# EAGLE design OpenBook (EAGLE 9.7.0)
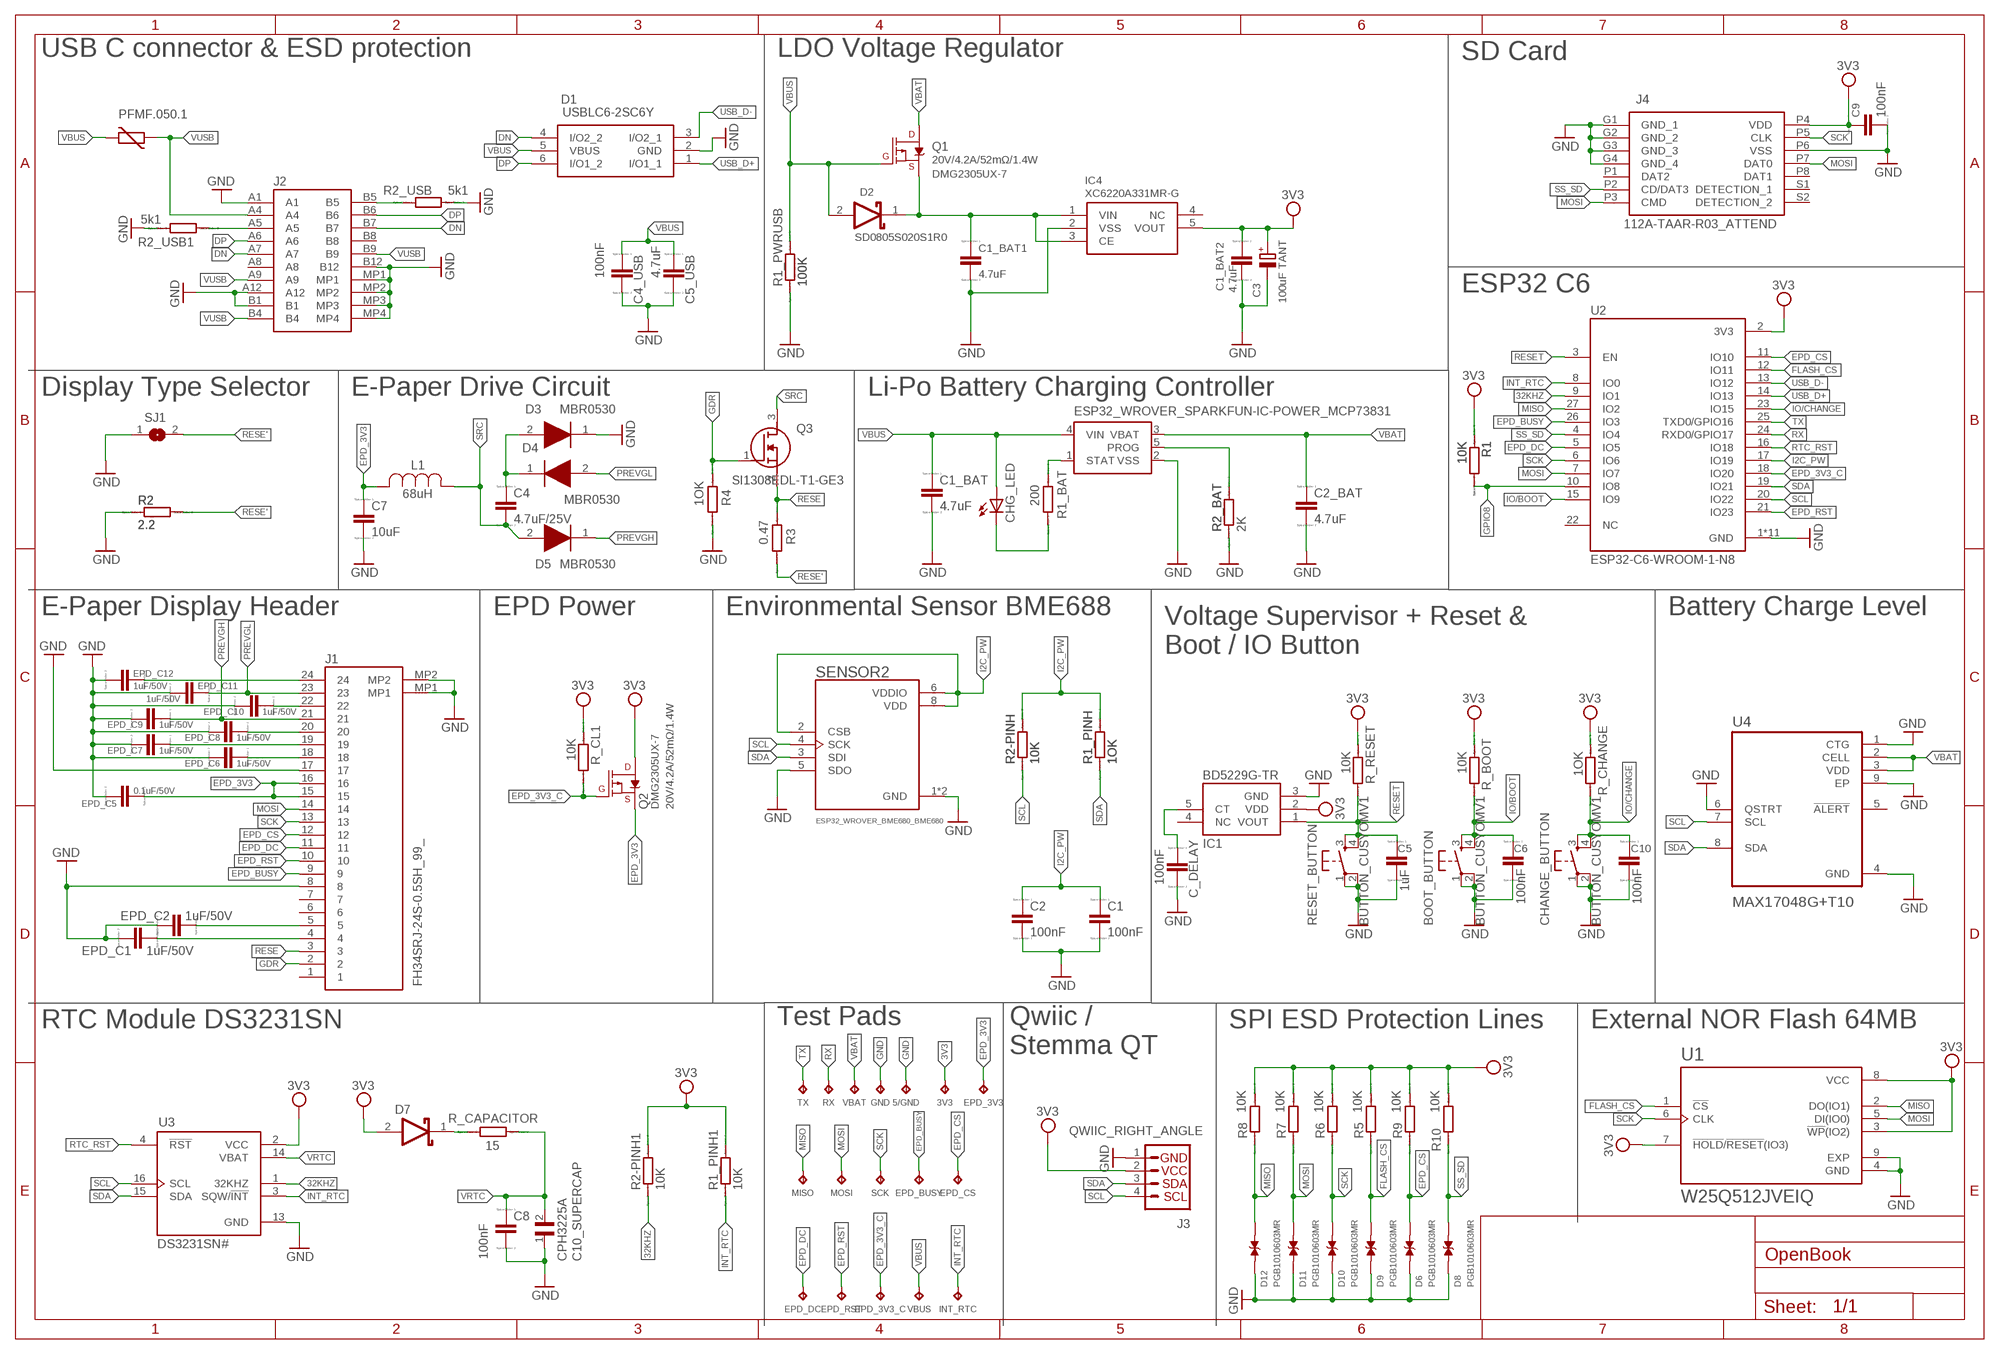
[diagram p0: schematic, sheet 1]

## Parts
3V3  TPTP20R  [TP20R]
5/GND  TPTP20R  [TP20R]
BOOT_BUTTON  BUTTON_CUSYOMV1  [MYBUTTON]
C1  100nF  ESP32_WROVER_EAGLE-LTSPICE_CC0402  [ESP32_WROVER_EAGLE-LTSPICE_C0402]
C1_BAT  4.7uF  ESP32_WROVER_EAGLE-LTSPICE_CC0402  [ESP32_WROVER_EAGLE-LTSPICE_C0402]
C1_BAT1  4.7uF  ESP32_WROVER_EAGLE-LTSPICE_CC0402  [ESP32_WROVER_EAGLE-LTSPICE_C0402]
C1_BAT2  4.7uF  ESP32_WROVER_EAGLE-LTSPICE_CC0402  [ESP32_WROVER_EAGLE-LTSPICE_C0402]
C2  100nF  ESP32_WROVER_EAGLE-LTSPICE_CC0402  [ESP32_WROVER_EAGLE-LTSPICE_C0402]
C2_BAT  4.7uF  ESP32_WROVER_EAGLE-LTSPICE_CC0402  [ESP32_WROVER_EAGLE-LTSPICE_C0402]
C3  100uF TANT  RCL_CPOL-EUCT3528  [RCL_CT3528]
C4  4.7uF/25V  ESP32_WROVER_EAGLE-LTSPICE_CC0402  [ESP32_WROVER_EAGLE-LTSPICE_C0402]
C4_USB  100nF  ESP32_WROVER_EAGLE-LTSPICE_CC0402  [ESP32_WROVER_EAGLE-LTSPICE_C0402]
C5  1uF  ESP32_WROVER_EAGLE-LTSPICE_CC0402  [ESP32_WROVER_EAGLE-LTSPICE_C0402]
C5_USB  4.7uF  ESP32_WROVER_EAGLE-LTSPICE_CC0402  [ESP32_WROVER_EAGLE-LTSPICE_C0402]
C6  100nF  ESP32_WROVER_EAGLE-LTSPICE_CC0402  [ESP32_WROVER_EAGLE-LTSPICE_C0402]
C7  10uF  ESP32_WROVER_EAGLE-LTSPICE_CC0402  [ESP32_WROVER_EAGLE-LTSPICE_C0402]
C8  100nF  ESP32_WROVER_EAGLE-LTSPICE_CC0402  [ESP32_WROVER_EAGLE-LTSPICE_C0402]
C9  100nF  ESP32_WROVER_EAGLE-LTSPICE_CC0402  [ESP32_WROVER_EAGLE-LTSPICE_C0402]
C10  100nF  ESP32_WROVER_EAGLE-LTSPICE_CC0402  [ESP32_WROVER_EAGLE-LTSPICE_C0402]
C10_SUPERCAP  CPH3225A  [CAPCP3225X100N]
C_DELAY  100nF  ESP32_WROVER_EAGLE-LTSPICE_CC0402  [ESP32_WROVER_EAGLE-LTSPICE_C0402]
CHANGE_BUTTON  BUTTON_CUSYOMV1  [MYBUTTON]
CHG_LED  ADAFRUIT_LEDCHIP-LED0603  [ADAFRUIT_CHIP-LED0603]
D1  USBLC6-2SC6Y  [SOT95P280X145-6N]
D2  ESP32_WROVER_AVX---SD0805S020S1R0_AVX_SD0805S020S1R0_0_0AVX_SD0805S020S1R0_0_0  [ESP32_WROVER_AVX---SD0805S020S1R0_AVX_SD0805S020S1R0_0]
D3  MBR0530  [SOD3716X135N]
D4  MBR0530  [SOD3716X135N]
D5  MBR0530  [SOD3716X135N]
D6  PGB1010603MR  [DIOC1608X36N]
D7  ESP32_WROVER_AVX---SD0805S020S1R0_AVX_SD0805S020S1R0_0_0AVX_SD0805S020S1R0_0_0  [ESP32_WROVER_AVX---SD0805S020S1R0_AVX_SD0805S020S1R0_0]
D8  PGB1010603MR  [DIOC1608X36N]
D9  PGB1010603MR  [DIOC1608X36N]
D10  PGB1010603MR  [DIOC1608X36N]
D11  PGB1010603MR  [DIOC1608X36N]
D12  PGB1010603MR  [DIOC1608X36N]
EPD_3V3  TPTP20R  [TP20R]
EPD_3V3_C  TPTP20R  [TP20R]
EPD_BUSY  TPTP20R  [TP20R]
EPD_C1  1uF/50V  ESP32_WROVER_EAGLE-LTSPICE_CC0402  [ESP32_WROVER_EAGLE-LTSPICE_C0402]
EPD_C2  1uF/50V  ESP32_WROVER_EAGLE-LTSPICE_CC0402  [ESP32_WROVER_EAGLE-LTSPICE_C0402]
EPD_C5  0.1uF/50V  ESP32_WROVER_EAGLE-LTSPICE_CC0402  [ESP32_WROVER_EAGLE-LTSPICE_C0402]
EPD_C6  1uF/50V  ESP32_WROVER_EAGLE-LTSPICE_CC0402  [ESP32_WROVER_EAGLE-LTSPICE_C0402]
EPD_C7  1uF/50V  ESP32_WROVER_EAGLE-LTSPICE_CC0402  [ESP32_WROVER_EAGLE-LTSPICE_C0402]
EPD_C8  1uF/50V  ESP32_WROVER_EAGLE-LTSPICE_CC0402  [ESP32_WROVER_EAGLE-LTSPICE_C0402]
EPD_C9  1uF/50V  ESP32_WROVER_EAGLE-LTSPICE_CC0402  [ESP32_WROVER_EAGLE-LTSPICE_C0402]
EPD_C10  1uF/50V  ESP32_WROVER_EAGLE-LTSPICE_CC0402  [ESP32_WROVER_EAGLE-LTSPICE_C0402]
EPD_C11  1uF/50V  ESP32_WROVER_EAGLE-LTSPICE_CC0402  [ESP32_WROVER_EAGLE-LTSPICE_C0402]
EPD_C12  1uF/50V  ESP32_WROVER_EAGLE-LTSPICE_CC0402  [ESP32_WROVER_EAGLE-LTSPICE_C0402]
EPD_CS  TPTP20R  [TP20R]
EPD_DC  TPTP20R  [TP20R]
EPD_RST  TPTP20R  [TP20R]
GND  TPTP20R  [TP20R]
IC1  BD5229G-TR  [SOT95P280X125-5N]
IC4  XC6220A331MR-G  [SOT95P280X120-5N]
INT_RTC  TPTP20R  [TP20R]
J1  FH34SRJ-24S-0.5SH_99_  [FH34SRJ24S05SH99]
J2  SAMACSYS_PARTS_USB4110-GF-A  [SAMACSYS_PARTS_USB4110GFA]
J3  QWIIC_RIGHT_ANGLE  QWIIC_CONNECTORJS-1MM  [JST04_1MM_RA]
J4  112A-TAAR-R03_ATTEND  [112ATAARR03ATTEND]
L1  744043680IND_4828-WE-TPC_WRE  [IND_4828-WE-TPC_WRE]
MISO  TPTP20R  [TP20R]
MOSI  TPTP20R  [TP20R]
PFMF.050.1  ESP32C6_VARISTORCN1812  [ESP32C6_VARISTOR_CT/CN1812]
Q1  20V/4.2A/52mΩ/1.4W  ESP32_WROVER_SPARKFUN-DISCRETESEMI_MOSFET_PCH-DMG2305UX-7  [ESP32_WROVER_SPARKFUN-DISCRETESEMI_SOT23-3]
Q2  20V/4.2A/52mΩ/1.4W  ESP32_WROVER_SPARKFUN-DISCRETESEMI_MOSFET_PCH-DMG2305UX-7  [ESP32_WROVER_SPARKFUN-DISCRETESEMI_SOT23-3]
Q3  SI1308EDL-T1-GE3  [SOT65P210X110-3N]
R1  10K  ESP32_WROVER_EAGLE-LTSPICE_RR0402  [ESP32_WROVER_EAGLE-LTSPICE_R0402]
R1_BAT  200  ESP32_WROVER_EAGLE-LTSPICE_RR0402  [ESP32_WROVER_EAGLE-LTSPICE_R0402]
R1_PINH  1OK  ESP32_WROVER_EAGLE-LTSPICE_RR0402  [ESP32_WROVER_EAGLE-LTSPICE_R0402]
R1_PINH1  10K  ESP32_WROVER_EAGLE-LTSPICE_RR0402  [ESP32_WROVER_EAGLE-LTSPICE_R0402]
R1_PWRUSB  100K  ESP32_WROVER_EAGLE-LTSPICE_RR0402  [ESP32_WROVER_EAGLE-LTSPICE_R0402]
R2  2.2  ESP32_WROVER_EAGLE-LTSPICE_RR0402  [ESP32_WROVER_EAGLE-LTSPICE_R0402]
R2-PINH  10K  ESP32_WROVER_EAGLE-LTSPICE_RR0402  [ESP32_WROVER_EAGLE-LTSPICE_R0402]
R2-PINH1  10K  ESP32_WROVER_EAGLE-LTSPICE_RR0402  [ESP32_WROVER_EAGLE-LTSPICE_R0402]
R2_BAT  2K  ESP32_WROVER_EAGLE-LTSPICE_RR0402  [ESP32_WROVER_EAGLE-LTSPICE_R0402]
R2_USB  5k1  ESP32_WROVER_EAGLE-LTSPICE_RR0402  [ESP32_WROVER_EAGLE-LTSPICE_R0402]
R2_USB1  5k1  ESP32_WROVER_EAGLE-LTSPICE_RR0402  [ESP32_WROVER_EAGLE-LTSPICE_R0402]
R3  0.47  ESP32_WROVER_EAGLE-LTSPICE_RR0402  [ESP32_WROVER_EAGLE-LTSPICE_R0402]
R4  1OK  ESP32_WROVER_EAGLE-LTSPICE_RR0402  [ESP32_WROVER_EAGLE-LTSPICE_R0402]
R5  10K  ESP32_WROVER_EAGLE-LTSPICE_RR0402  [ESP32_WROVER_EAGLE-LTSPICE_R0402]
R6  10K  ESP32_WROVER_EAGLE-LTSPICE_RR0402  [ESP32_WROVER_EAGLE-LTSPICE_R0402]
R7  10K  ESP32_WROVER_EAGLE-LTSPICE_RR0402  [ESP32_WROVER_EAGLE-LTSPICE_R0402]
R8  10K  ESP32_WROVER_EAGLE-LTSPICE_RR0402  [ESP32_WROVER_EAGLE-LTSPICE_R0402]
R9  10K  ESP32_WROVER_EAGLE-LTSPICE_RR0402  [ESP32_WROVER_EAGLE-LTSPICE_R0402]
R10  10K  ESP32_WROVER_EAGLE-LTSPICE_RR0402  [ESP32_WROVER_EAGLE-LTSPICE_R0402]
R_BOOT  10K  ESP32_WROVER_EAGLE-LTSPICE_RR0402  [ESP32_WROVER_EAGLE-LTSPICE_R0402]
R_CAPACITOR  15  ESP32_WROVER_EAGLE-LTSPICE_RR0402  [ESP32_WROVER_EAGLE-LTSPICE_R0402]
R_CHANGE  1OK  ESP32_WROVER_EAGLE-LTSPICE_RR0402  [ESP32_WROVER_EAGLE-LTSPICE_R0402]
R_CL1  10K  ESP32_WROVER_EAGLE-LTSPICE_RR0402  [ESP32_WROVER_EAGLE-LTSPICE_R0402]
R_RESET  10K  ESP32_WROVER_EAGLE-LTSPICE_RR0402  [ESP32_WROVER_EAGLE-LTSPICE_R0402]
RESET_BUTTON  BUTTON_CUSYOMV1  [MYBUTTON]
RX  TPTP20R  [TP20R]
SCK  TPTP20R  [TP20R]
SENSOR2  ESP32_WROVER_BME680_BME680  [ESP32_WROVER_BME680_PSON80P300X300X100-8N]
SJ1  SJ  [SJ]
TX  TPTP20R  [TP20R]
U0  ESP32_WROVER_SPARKFUN-IC-POWER_MCP73831  [ESP32_WROVER_SPARKFUN-IC-POWER_SOT23-5]
U1  W25Q512JVEIQ  [SON127P600X800X80-9N]
U2  ESP32-C6-WROOM-1-N8  [XCVR_ESP32-C6-WROOM-1-N8]
U3  DS3231SN#  [SOIC127P1032X265-16N]
U4  MAX17048G+T10  [SON50P200X200X80-9N]
VBAT  TPTP20R  [TP20R]
VBUS  TPTP20R  [TP20R]

## Nets
3V3 [power_lines]: 3V3.TP C1_BAT2.1 C3.+ C9.1 D7.2(ANODE) IC1.2(VDD) IC4.5(VOUT) J3.2 J4.P4(VDD) Q2.3(D) R1.1 R1_PINH1.2 R2-PINH1.2 R5.2 R6.2 R7.2 R8.2 R9.2 R10.2 R_BOOT.1 R_CHANGE.1 R_CL1.1 R_RESET.1 U1.3(!WP!(IO2)) U1.7(!HOLD!/!RESET!(IO3)) U1.8(VCC) U2.2(3V3) U3.2(VCC)
32KHZ: R2-PINH1.1 U2.9(IO1) U3.1(32KHZ)
DN: D1.4(I/O2_2) J2.A7 J2.B7
DP: D1.6(I/O1_2) J2.A6 J2.B6
EPD_3V3 [power_lines]: C7.1 EPD_3V3.TP EPD_C5.1 J1.15 J1.16 L1.2 Q2.2(S)
EPD_3V3_C [power_lines]: EPD_3V3_C.TP Q2.1(G) R_CL1.2 U2.18(IO20)
EPD_BUSY: EPD_BUSY.TP J1.9 U2.26(IO3)
EPD_CS: D6.2 EPD_CS.TP J1.12 R9.1 U2.11(IO10)
EPD_DC: EPD_DC.TP J1.11 U2.5(IO5)
EPD_RST: EPD_RST.TP J1.10 U2.21(IO23)
FLASH_CS: D9.2 R5.1 U1.1(!CS) U2.12(IO11)
GDR: J1.2 Q3.1(G) R4.2
GND: 5/GND.TP BOOT_BUTTON.1 BOOT_BUTTON.2 C1.2 C1_BAT1.2 C1_BAT2.2 C1_BAT.2 C2.2 C2_BAT.2 C3.- C4_USB.2 C5.2 C5_USB.2 C6.2 C7.2 C8.2 C9.2 C10.2 C10_SUPERCAP.1 C_DELAY.2 CHANGE_BUTTON.1 CHANGE_BUTTON.2 D1.2(GND) D4.1(K) D6.1 D8.1 D9.1 D10.1 D11.1 D12.1 EPD_C1.2 EPD_C2.2 EPD_C5.2 EPD_C6.2 EPD_C7.2 EPD_C8.2 EPD_C9.2 EPD_C10.2 EPD_C11.2 EPD_C12.2 GND.TP IC1.3(GND) IC4.2(VSS) J1.8 J1.17 J1.MP1 J1.MP2 J2.A1 J2.A12 J2.B1 J2.B12 J2.MP1 J2.MP2 J2.MP3 J2.MP4 J3.1 J4.G1(GND_1) J4.G2(GND_2) J4.G3(GND_3) J4.G4(GND_4) J4.P6(VSS) R1_PWRUSB.1 R2.1 R2_BAT.1 R2_USB1.1 R2_USB.2 R4.1 RESET_BUTTON.1 RESET_BUTTON.2 SENSOR2.1(GND) SENSOR2.5(SDO) SENSOR2.7(GND) SJ1.1 U0.2(VSS) U1.4(GND) U1.9(EXP) U2.1(GND) U2.28(GND) U2.29_1(GND) U2.29_2(GND) U2.29_3(GND) U2.29_4(GND) U2.29_5(GND) U2.29_6(GND) U2.29_7(GND) U2.29_8(GND) U2.29_9(GND) U3.13(GND) U4.1(CTG) U4.4(GND) U4.6(QSTRT) U4.9(EP)
GPIO8: R1.2 U2.10(IO8)
I2C_PW: C1.1 C2.1 R1_PINH.2 R2-PINH.2 SENSOR2.2(CSB) SENSOR2.6(VDDIO) SENSOR2.8(VDD) U2.17(IO19)
INT_RTC: INT_RTC.TP R1_PINH1.1 U2.8(IO0) U3.3(SQW/!INT)
IO/BOOT: BOOT_BUTTON.3 BOOT_BUTTON.4 C6.1 R_BOOT.2 U2.15(IO9)
IO/CHANGE: C10.1 CHANGE_BUTTON.3 CHANGE_BUTTON.4 R_CHANGE.2 U2.23(IO15)
MISO: D12.2 MISO.TP R8.1 U1.2(DO(IO1)) U2.27(IO2)
MOSI: D11.2 J1.14 J4.P3(CMD) J4.P7(DAT0) MOSI.TP R7.1 U1.5(DI(IO0)) U2.7(IO7)
N$1: J2.A5 R2_USB1.2
N$2: J2.B5 R2_USB.1
N$3: C1_BAT1.1 D2.1(CATHODE) IC4.1(VIN) IC4.3(CE) Q1.2(S)
N$4: R1_BAT.2 U0.1(STAT)
N$5: C4.1 D3.1(K) D4.2(A)
N$6: CHG_LED.C R1_BAT.1
N$7: D7.1(CATHODE) R_CAPACITOR.2
N$8: R2_BAT.2 U0.5(PROG)
N$9: EPD_C12.1 J1.24
N$10: C_DELAY.1 IC1.5(CT)
N$11: EPD_C10.1 J1.22
N$13: EPD_C7.1 J1.19
N$14: EPD_C8.1 J1.20
N$15: EPD_C6.1 J1.18
N$19: EPD_C1.1 J1.4
N$20: EPD_C2.1 J1.5
PREVGH: D5.1(K) EPD_C9.1 J1.21
PREVGL: D3.2(A) EPD_C11.1 J1.23
RESE: J1.3 Q3.2(S) R3.2
RESE': R2.2 R3.1 SJ1.2
RESET: C5.1 IC1.1(VOUT) R_RESET.2 RESET_BUTTON.3 RESET_BUTTON.4 U2.3(EN)
RTC_RST: U2.16(IO18) U3.4(!RST)
RX: RX.TP U2.24(RXD0/GPIO17)
SCK: D10.2 J1.13 J4.P5(CLK) R6.1 SCK.TP U1.6(CLK) U2.6(IO6)
SCL: J3.4 R2-PINH.1 SENSOR2.4(SCK) U2.20(IO22) U3.16(SCL) U4.7(SCL)
SDA: J3.3 R1_PINH.1 SENSOR2.3(SDI) U2.19(IO21) U3.15(SDA) U4.8(SDA)
SRC: C4.2 D5.2(A) L1.1 Q3.3(D)
SS_SD: D8.2 J4.P2(CD/DAT3) R10.1 U2.4(IO4)
TX: TX.TP U2.25(TXD0/GPIO16)
USB_D+: D1.1(I/O1_1) U2.14(IO13)
USB_D-: D1.3(I/O2_1) U2.13(IO12)
VBAT [power_lines]: C2_BAT.1 Q1.3(D) U0.3(VBAT) U4.2(CELL) U4.3(VDD) VBAT.TP
VBUS [power_lines]: C1_BAT.1 C4_USB.1 C5_USB.1 CHG_LED.A D1.5(VBUS) D2.2(ANODE) PFMF.050.1.2 Q1.1(G) R1_PWRUSB.2 U0.4(VIN) VBUS.TP
VRTC [power_lines]: C8.1 C10_SUPERCAP.2 R_CAPACITOR.1 U3.14(VBAT)
VUSB [power_lines]: J2.A4 J2.A9 J2.B4 J2.B9 PFMF.050.1.1
Unconnected: IC1.4(NC) IC4.4(NC) J1.1 J1.6 J1.7 J2.A8 J2.B8 J4.P1(DAT2) J4.P8(DAT1) J4.S1(DETECTION_1) J4.S2(DETECTION_2) U2.22(NC) U4.5(!ALERT)

## Notes on the sheet
- SD Card
- USB C connector & ESD protection | LDO Voltage Regulator
- DMG2305UX-7
- SD0805S020S1R0
- ESP32 C6
- Display Type Selector | E-Paper Drive Circuit | Li-Po Battery Charging Controller
- 68uH
- E-Paper Display Header | EPD Power | Environmental Sensor BME688 | Battery Charge Level
- Voltage Supervisor + Reset &
  Boot / IO Button
- DMG2305UX-7
- RTC Module DS3231SN | SPI ESD Protection Lines | External NOR Flash 64MB
- Test Pads
- Qwiic / 
  Stemma QT

## Library data of the parts
3V3 5/GND EPD_3V3 EPD_3V3_C EPD_BUSY EPD_CS EPD_DC EPD_RST GND INT_RTC MISO MOSI RX SCK TX VBAT VBUS = DeskAssistant v19 v1:TP: Test pad
BOOT_BUTTON CHANGE_BUTTON RESET_BUTTON = DeskAssistant v19 v1:BUTTON_CUSYOMV1
C1 C1_BAT C1_BAT1 C1_BAT2 C2 C2_BAT C4 C4_USB C5 C5_USB C6-C10 C_DELAY EPD_C1 EPD_C2 EPD_C5-EPD_C12 = DeskAssistant v19 v1:ESP32_WROVER_EAGLE-LTSPICE_C: CAPACITOR, European symbol; SPICEMODEL: NONE; SPICEPREFIX: C
C3 = DeskAssistant v19 v1:RCL_CPOL-EU: POLARIZED CAPACITOR, European symbol; SPICEPREFIX: C
C10_SUPERCAP = DeskAssistant v19 v1:CPH3225A: Cap 0.011F 3.3V 1210 Flat Check availability <https://pricing.snapeda.com/parts/CPH3225A/Seiko%20Instruments/view-part?ref=eda>; AVAILABILITY: Not in stock; CHECK_PRICES: https://www.snapeda.com/parts/CPH3225A/Seiko+Instruments/view-part/?ref=eda; DESCRIPTION: 11 mF (EDLC) Supercapacitor 3.3 V 1210 (3225 Metric) - -; MF: Seiko Instruments; MP: CPH3225A; PACKAGE: 1210 Seiko; PRICE: None; PURCHASE-URL: https://www.snapeda.com/api/url_track_click_mouser/?unipart_id=562593&manufacturer=Seiko Instruments&part_name=CPH3225A&search_term=None; SNAPEDA_LINK: https://www.snapeda.com/parts/CPH3225A/Seiko+Instruments/view-part/?ref=snap
CHG_LED = DeskAssistant v19 v1:ADAFRUIT_LED: LED OSRAM: - CHIPLED LG R971, LG N971, LY N971, LG Q971, LY Q971, LO R971, LY R971 LH N974, LH R974 LS Q976, LO Q976, LY Q976 LO Q996 - Hyper CHIPLED LW Q18S LB Q993, LB Q99A, LB R99A - SideLED LS A670, LO A670, LY A670, LG A670, LP A670 LB A673, LV A673, LT A673, LW A673 LH A674 LY A675 LS A676, LA A676, LO A676, LY A676, LW A676 LS A679, LY A679, LG A679 - Hyper Micro SIDELED® LS Y876, LA Y876, LO Y876, LY Y876 LT Y87S - SmartLED LW L88C, LW L88S LB L89C, LB L89S, LG L890 LS L89K, LO L89K, LY L89K LS L896, LA L896, LO L896, LY L896 - TOPLED LS T670, LO T670, LY T670, LG T670, LP T670 LSG T670, LSP T670, LSY T670, LOP T670, LYG T670 LG T671, LOG T671, LSG T671 LB T673, LV T673, LT T673, LW T673 LH T674 LS T676, LA T676, LO T676, LY T676, LB T676, LH T676, LSB T676, LW T676 LB T67C, LV T67C, LT T67C, LS T67K, LO T67K, LY T67K, LW E67C LS E67B, LA E67B, LO E67B, LY E67B, LB E67C, LV E67C, LT E67C LW T67C LS T679, LY T679, LG T679 LS T770, LO T770, LY T770, LG T770, LP T770 LB T773, LV T773, LT T773, LW T773 LH T774 LS E675, LA E675, LY E675, LS T675 LS T776, LA T776, LO T776, LY T776, LB T776 LHGB T686 LT T68C, LB T68C - Hyper Mini TOPLED® LB M676 - Mini TOPLED Santana® LG M470 LS M47K, LO M47K, LY M47K Source: http://www.osram.convergy.de/
D1 = DeskAssistant v19 v1:USBLC6-2SC6Y: Low Cap. ESD Protection Auto SOT-23-6 STMicroelectronics USBLC6-2SC6Y, Dual Uni-Directional TVS Diode Array, 6-Pin SOT-23 Source: Datasheet <https://componentsearchengine.com/Datasheets/1/USBLC6-2SC6Y.pdf> Check availability <https://pricing.snapeda.com/parts/USBLC6-2SC6Y/STMicroelectronics/view-part?ref=eda>; AVAILABILITY: In Stock; CHECK_PRICES: https://www.snapeda.com/parts/USBLC6-2SC6Y/STMicroelectronics/view-part/?ref=eda; DESCRIPTION: 17V Clamp 5A (8/20µs) Ipp Tvs Diode Surface Mount SOT-23-6; MF: STMicroelectronics; MP: USBLC6-2SC6Y; PACKAGE: SOT-23-6 STMicroelectronics; PRICE: None; SNAPEDA_LINK: https://www.snapeda.com/parts/USBLC6-2SC6Y/STMicroelectronics/view-part/?ref=snap
D2 D7 = DeskAssistant v19 v1:ESP32_WROVER_AVX---SD0805S020S1R0_AVX_SD0805S020S1R0_0_0: Schottky Barrier Rectifier Diode; CENTROID_NOT_SPECIFIED: No; DATASHEET: http://datasheets.avx.com/schottky.pdf; DIGIKEY_DESCRIPTION: DIODE SCHOTTKY 20V 1A 0805; DIGIKEY_PART_NUMBER: 478-7800-1-ND; LEAD_FREE: yes; MF: AVX; MOUSER_PART_NUMBER: 581-SD0805S020S1R0; PACKAGE: 0805 (2012 metric); PREFIX: D; ROHS: yes; TEMPERATURE_RANGE_HIGH: +125°C; TEMPERATURE_RANGE_LOW: -55°C
D3-D5 = DeskAssistant v19 v1:MBR0530: ON SEMICONDUCTOR - MBR0530 - DIODE, SCHOTTKY, 0.5A, 30V, SOD-123 Source: Datasheet <http://www.onsemi.com/pub/Collateral/MBR0530T1-D.PDF> Check availability <https://pricing.snapeda.com/parts/MBR0530/ON%20Semiconductor/view-part?ref=eda>; AVAILABILITY: In Stock; CHECK_PRICES: https://www.snapeda.com/parts/MBR0530/Onsemi/view-part/?ref=eda; DESCRIPTION: Diode Schottky 30 V 500mA Surface Mount SOD-123; MF: ON Semiconductor; MP: MBR0530; PACKAGE: SOD-123-2 ON Semiconductor; PRICE: None; PURCHASE-URL: https://www.snapeda.com/api/url_track_click_mouser/?unipart_id=179458&manufacturer=ON Semiconductor&part_name=MBR0530&search_term=None; SNAPEDA_LINK: https://www.snapeda.com/parts/MBR0530/Onsemi/view-part/?ref=snap
D6 D8-D12 = DeskAssistant v19 v1:PGB1010603MR: Check availability <https://pricing.snapeda.com/parts/PGB1010603MR/Littelfuse%20Inc./view-part?ref=eda>; AVAILABILITY: In Stock; CHECK_PRICES: https://www.snapeda.com/parts/PGB1010603MR/Littelfuse/view-part/?ref=eda; DESCRIPTION: 150V (Typ) Clamp - Ipp Tvs Diode Surface Mount 0603 (1608 Metric); MF: Littelfuse Inc.; MP: PGB1010603MR; PACKAGE: 0603 Littelfuse Inc.; PRICE: None; PURCHASE-URL: https://www.snapeda.com/api/url_track_click_mouser/?unipart_id=5659453&manufacturer=Littelfuse Inc.&part_name=PGB1010603MR&search_term=None; SNAPEDA_LINK: https://www.snapeda.com/parts/PGB1010603MR/Littelfuse/view-part/?ref=snap
IC1 = DeskAssistant v19 v1:BD5229G-TR: Voltage Detector with Adjustable Delay Time: CMOS processes are utilized to develop high precision, low current consumption CMOS reset ICs that allow arbitrary setting of the delay time. The extensive lineup includes both Nch Open Drain and CMOS output types in a wide range of detection voltages (from 2.3V to 6.0V, in 0.1V steps), enabling selection of the ideal solution based on customer requirements. In addition, the entire series is of course both lead-free and RoHS-compliant. Source: Datasheet <https://datasheet.datasheetarchive.com/originals/distributors/Datasheets_SAMA/f2b9741ef86007909f138d561a359946.pdf>; DESCRIPTION: Voltage Detector with Adjustable Delay Time: CMOS processes are utilized to develop high precision, low current consumption CMOS reset ICs that allow arbitrary setting of the delay time. The extensive lineup includes both Nch Open Drain and CMOS output types in a wide range of detection voltages (from 2.3V to 6.0V, in 0.1V steps), enabling selection of the ideal solution based on customer requirements. In addition, the entire series is of course both lead-free and RoHS-compliant.; HEIGHT: 1.25mm; MANUFACTURER_NAME: ROHM Semiconductor; MANUFACTURER_PART_NUMBER: BD5229G-TR; MOUSER_PART_NUMBER: 755-BD5229G-TR; MOUSER_PRICE-STOCK: https://www.mouser.co.uk/ProductDetail/ROHM-Semiconductor/BD5229G-TR?qs=4kLU8WoGk0vvnhrrYwdszw%3D%3D
IC4 = DeskAssistant v19 v1:XC6220A331MR-G: LDO Voltage Regulators Source: Datasheet <https://www.torexsemi.com/file/xc6220/XC6220.pdf>; DESCRIPTION: LDO Voltage Regulators; HEIGHT: 1.2mm; MANUFACTURER_NAME: Torex; MANUFACTURER_PART_NUMBER: XC6220A331MR-G; MOUSER_PART_NUMBER: 865-XC6220A331MR-G; MOUSER_PRICE-STOCK: https://www.mouser.co.uk/ProductDetail/Torex-Semiconductor/XC6220A331MR-G?qs=AsjdqWjXhJ8ZSWznL1J0gg%3D%3D
J1 = DeskAssistant v19 v1:FH34SRJ-24S-0.5SH_99_: 24 Position FFC, FPC Connector Contacts, Top and Bottom 0.020" (0.50mm) Surface Mount, Right Angle Source: Datasheet <https://www.hirose.com/en/product/document?clcode=CL0580-1255-6-99&productname=FH34SRJ-24S-0.5SH(99)&series=FH34SRJ&documenttype=2DDrawing&lang=en&documentid=0000990903>; DESCRIPTION: 24 Position FFC, FPC Connector Contacts, Top and Bottom 0.020" (0.50mm) Surface Mount, Right Angle; HEIGHT: 1.1mm; MANUFACTURER_NAME: Hirose; MANUFACTURER_PART_NUMBER: FH34SRJ-24S-0.5SH(99); MOUSER_PART_NUMBER: 798-FH34SRJ24S05SH99; MOUSER_PRICE-STOCK: https://www.mouser.co.uk/ProductDetail/Hirose-Connector/FH34SRJ-24S-0.5SH99?qs=vcbW%252B4%252BSTIpKBl5ap9J8Fw%3D%3D
J2 = DeskAssistant v19 v1:SAMACSYS_PARTS_USB4110-GF-A: CONN USB 2.0 TYPE-C R/A SMT Source: Datasheet <https://gct.co/files/drawings/usb4110.pdf>; DESCRIPTION: CONN USB 2.0 TYPE-C R/A SMT; HEIGHT: 3.26mm; MANUFACTURER_NAME: GCT (GLOBAL CONNECTOR TECHNOLOGY); MANUFACTURER_PART_NUMBER: USB4110-GF-A; MOUSER_PART_NUMBER: 640-USB4110-GF-A; MOUSER_PRICE-STOCK: https://www.mouser.co.uk/ProductDetail/GCT/USB4110-GF-A?qs=KUoIvG%2F9IlYiZvIXQjyJeA%3D%3D
J3 = DeskAssistant v19 v1:QWIIC_CONNECTOR: SparkFun I2C Standard Qwiic Connector An SMD 1mm pitch JST connector makes it easy and quick (get it? Qwiic?) to connect I2C devices to each other. The Qwiic system <http://www.sparkfun.com/qwiic> enables fast and solderless connection between popular platforms and various sensors and actuators. We carry 200mm <https://www.sparkfun.com/products/14204>, 100mm <https://www.sparkfun.com/products/14205>, 50mm <https://www.sparkfun.com/products/14206>, and breadboard friendly <https://www.sparkfun.com/products/14207> Qwiic cables. We also offer 10 pcs strips <https://www.sparkfun.com/products/14323> the SMD connectors.; PROD_ID: CONN-13694
J4 = DeskAssistant v19 v1:112A-TAAR-R03_ATTEND: Micro SD Card Socket, Push-Push Type, Top Mount, SMT, H=1.83mm, 10u Source: Datasheet <https://www.attend.com.tw/data/download/file/112A-TAAR-R03.pdf>; DESCRIPTION: Micro SD Card Socket, Push-Push Type, Top Mount, SMT, H=1.83mm, 10u; HEIGHT: 1.9mm; MANUFACTURER_NAME: ATTEND; MANUFACTURER_PART_NUMBER: 112A-TAAR-R03 ATTEND
L1 = DeskAssistant v19 v1:744043680; COPYRIGHT: Copyright (C) 2024 Ultra Librarian. All rights reserved.; MANUFACTURER_PART_NUMBER: 744043680; MFR_NAME: Wurth Electronics
PFMF.050.1 = DeskAssistant v19 v1:ESP32C6_VARISTOR: VARISTOR
Q1 Q2 = DeskAssistant v19 v1:ESP32_WROVER_SPARKFUN-DISCRETESEMI_MOSFET_PCH: P-channel MOSFETs Voltage controlled devices that allow control of high current outputs. SparkFun Products: SparkFun ESP32 Thing <https://www.sparkfun.com/products/13907> SparkFun ESP8266 Thing <https://www.sparkfun.com/products/13231> SparkFun Pi Servo HAT V2 <https://www.sparkfun.com/products/15316> DMG2305UX-7 (20V/4.2A/SOT23-3); PROD_ID: TRAN-14388
Q3 = DeskAssistant v19 v1:SI1308EDL-T1-GE3: MOSFET N-Ch 30V 1.5A TrenchFET SC70 Vishay Si1308EDL-T1-GE3 N-channel MOSFET Transistor, 1.5 A, 30 V, 3-Pin SC-70 Source: Datasheet <https://componentsearchengine.com/Datasheets/1/SI1308EDL-T1-GE3.pdf> Check availability <https://pricing.snapeda.com/parts/SI1308EDL-T1-GE3/Vishay%20Siliconix/view-part?ref=eda>; AVAILABILITY: In Stock; CHECK_PRICES: https://www.snapeda.com/parts/SI1308EDL-T1-GE3/Vishay+Siliconix/view-part/?ref=eda; DESCRIPTION: Si1308EDL-T1-GE3 N-channel MOSFET Transistor, 1.5 A, 30 V, 3-Pin SC-70 | Siliconix / Vishay SI1308EDL-T1-GE3; MF: Vishay Siliconix; MP: SI1308EDL-T1-GE3; PACKAGE: SOT-323 Vishay Semiconductor; PRICE: None; PURCHASE-URL: https://www.snapeda.com/api/url_track_click_mouser/?unipart_id=274603&manufacturer=Vishay Siliconix&part_name=SI1308EDL-T1-GE3&search_term=None; SNAPEDA_LINK: https://www.snapeda.com/parts/SI1308EDL-T1-GE3/Vishay+Siliconix/view-part/?ref=snap
R1 R1_BAT R1_PINH R1_PINH1 R1_PWRUSB R2 R2-PINH R2-PINH1 R2_BAT R2_USB R2_USB1 R3-R10 R_BOOT R_CAPACITOR R_CHANGE R_CL1 R_RESET = DeskAssistant v19 v1:ESP32_WROVER_EAGLE-LTSPICE_R: RESISTOR, European symbol; SPICEMODEL: NONE; SPICEPREFIX: R
SENSOR2 = DeskAssistant v19 v1:ESP32_WROVER_BME680_BME680: Integrated Environmental Unit; AVAILABILITY: Unavailable; DESCRIPTION: Integrated Environmental Unit; MF: Bosch Sensortec; MP: BME680; PACKAGE: LGA-8 Bosch Tools; PRICE: None
SJ1 = DeskAssistant v19 v1:SJ: SMD solder JUMPER
U0 = DeskAssistant v19 v1:ESP32_WROVER_SPARKFUN-IC-POWER_MCP73831: MCP73831T Li-Ion, Li-Pol Controller Miniature single cell, fully integrated Li-Ion, Li-polymer charge management controller Datasheet <http://ww1.microchip.com/downloads/en/DeviceDoc/20001984g.pdf> SparkFun Products: SparkFun ESP32 Thing <https://www.sparkfun.com/products/13907> SparkFun 9DoF Razor IMU M0 <https://www.sparkfun.com/products/14001>; PROD_ID: IC-09995
U1 = DeskAssistant v19 v1:W25Q512JVEIQ: Check availability <https://pricing.snapeda.com/parts/W25Q512JVEIQ/Winbond%20Electronics/view-part?ref=eda>; AVAILABILITY: In Stock; CHECK_PRICES: https://www.snapeda.com/parts/W25Q512JVEIQ/Winbond+Electronics/view-part/?ref=eda; DESCRIPTION: FLASH - NOR Memory IC 512Mb (64M x 8) SPI - Quad I/O 133 MHz 8-WSON (8x6); MF: Winbond Electronics; MP: W25Q512JVEIQ; PACKAGE: Package; PRICE: None; SNAPEDA_LINK: https://www.snapeda.com/parts/W25Q512JVEIQ/Winbond+Electronics/view-part/?ref=snap
U2 = DeskAssistant v19 v1:ESP32-C6-WROOM-1-N8: Check availability <https://pricing.snapeda.com/parts/ESP32-C6-WROOM-1-N8/Espressif%20Systems/view-part?ref=eda>; AVAILABILITY: In Stock; CHECK_PRICES: https://www.snapeda.com/parts/ESP32-C6-WROOM-1-N8/Espressif+Systems/view-part/?ref=eda; DESCRIPTION: Multiprotocol Modules ESP32-C6 module, Wi-Fi 6 in 2.4 GHz band, Bluetooth 5, Zigbee 3.0 and Thread. ESP34-WROOM Compatible - ENGINEERING SAMPLE; MF: Espressif Systems; MP: ESP32-C6-WROOM-1-N8; PACKAGE: None; PRICE: None; SNAPEDA_LINK: https://www.snapeda.com/parts/ESP32-C6-WROOM-1-N8/Espressif+Systems/view-part/?ref=snap
U3 = DeskAssistant v19 v1:DS3231SN#: Real Time Clock Serial 16-Pin SOIC W T/R Check availability <https://pricing.snapeda.com/parts/DS3231SN%23/Analog%20Devices/view-part?ref=eda>; AVAILABILITY: In Stock; CHECK_PRICES: https://www.snapeda.com/parts/DS3231SN%23/Analog+Devices/view-part/?ref=eda; DESCRIPTION: Extremely Accurate I²C-Integrated RTC/TCXO/Crystal; MF: Analog Devices; MP: DS3231SN#; PACKAGE: SOIC-16 Maxim; PRICE: None; PURCHASE-URL: https://www.snapeda.com/api/url_track_click_mouser/?unipart_id=99048&manufacturer=Analog Devices&part_name=DS3231SN#&search_term=None; SNAPEDA_LINK: https://www.snapeda.com/parts/DS3231SN%23/Analog+Devices/view-part/?ref=snap
U4 = DeskAssistant v19 v1:MAX17048G+T10: Check availability <https://pricing.snapeda.com/parts/MAX17048G%2BT10/Analog%20Devices/view-part?ref=eda>; AVAILABILITY: In Stock; CHECK_PRICES: https://www.snapeda.com/parts/MAX17048G+T10/Analog+Devices/view-part/?ref=eda; DESCRIPTION: 3µA 1-Cell/2-Cell Fuel Gauge with ModelGauge; MF: Analog Devices; MP: MAX17048G+T10; PACKAGE: TDFN-8 Maxim; PRICE: None; PURCHASE-URL: https://www.snapeda.com/api/url_track_click_mouser/?unipart_id=329239&manufacturer=Analog Devices&part_name=MAX17048G+T10&search_term=None; SNAPEDA_LINK: https://www.snapeda.com/parts/MAX17048G+T10/Analog+Devices/view-part/?ref=snap

## Net classes
1 power_lines: width 0.3 mm

## Board
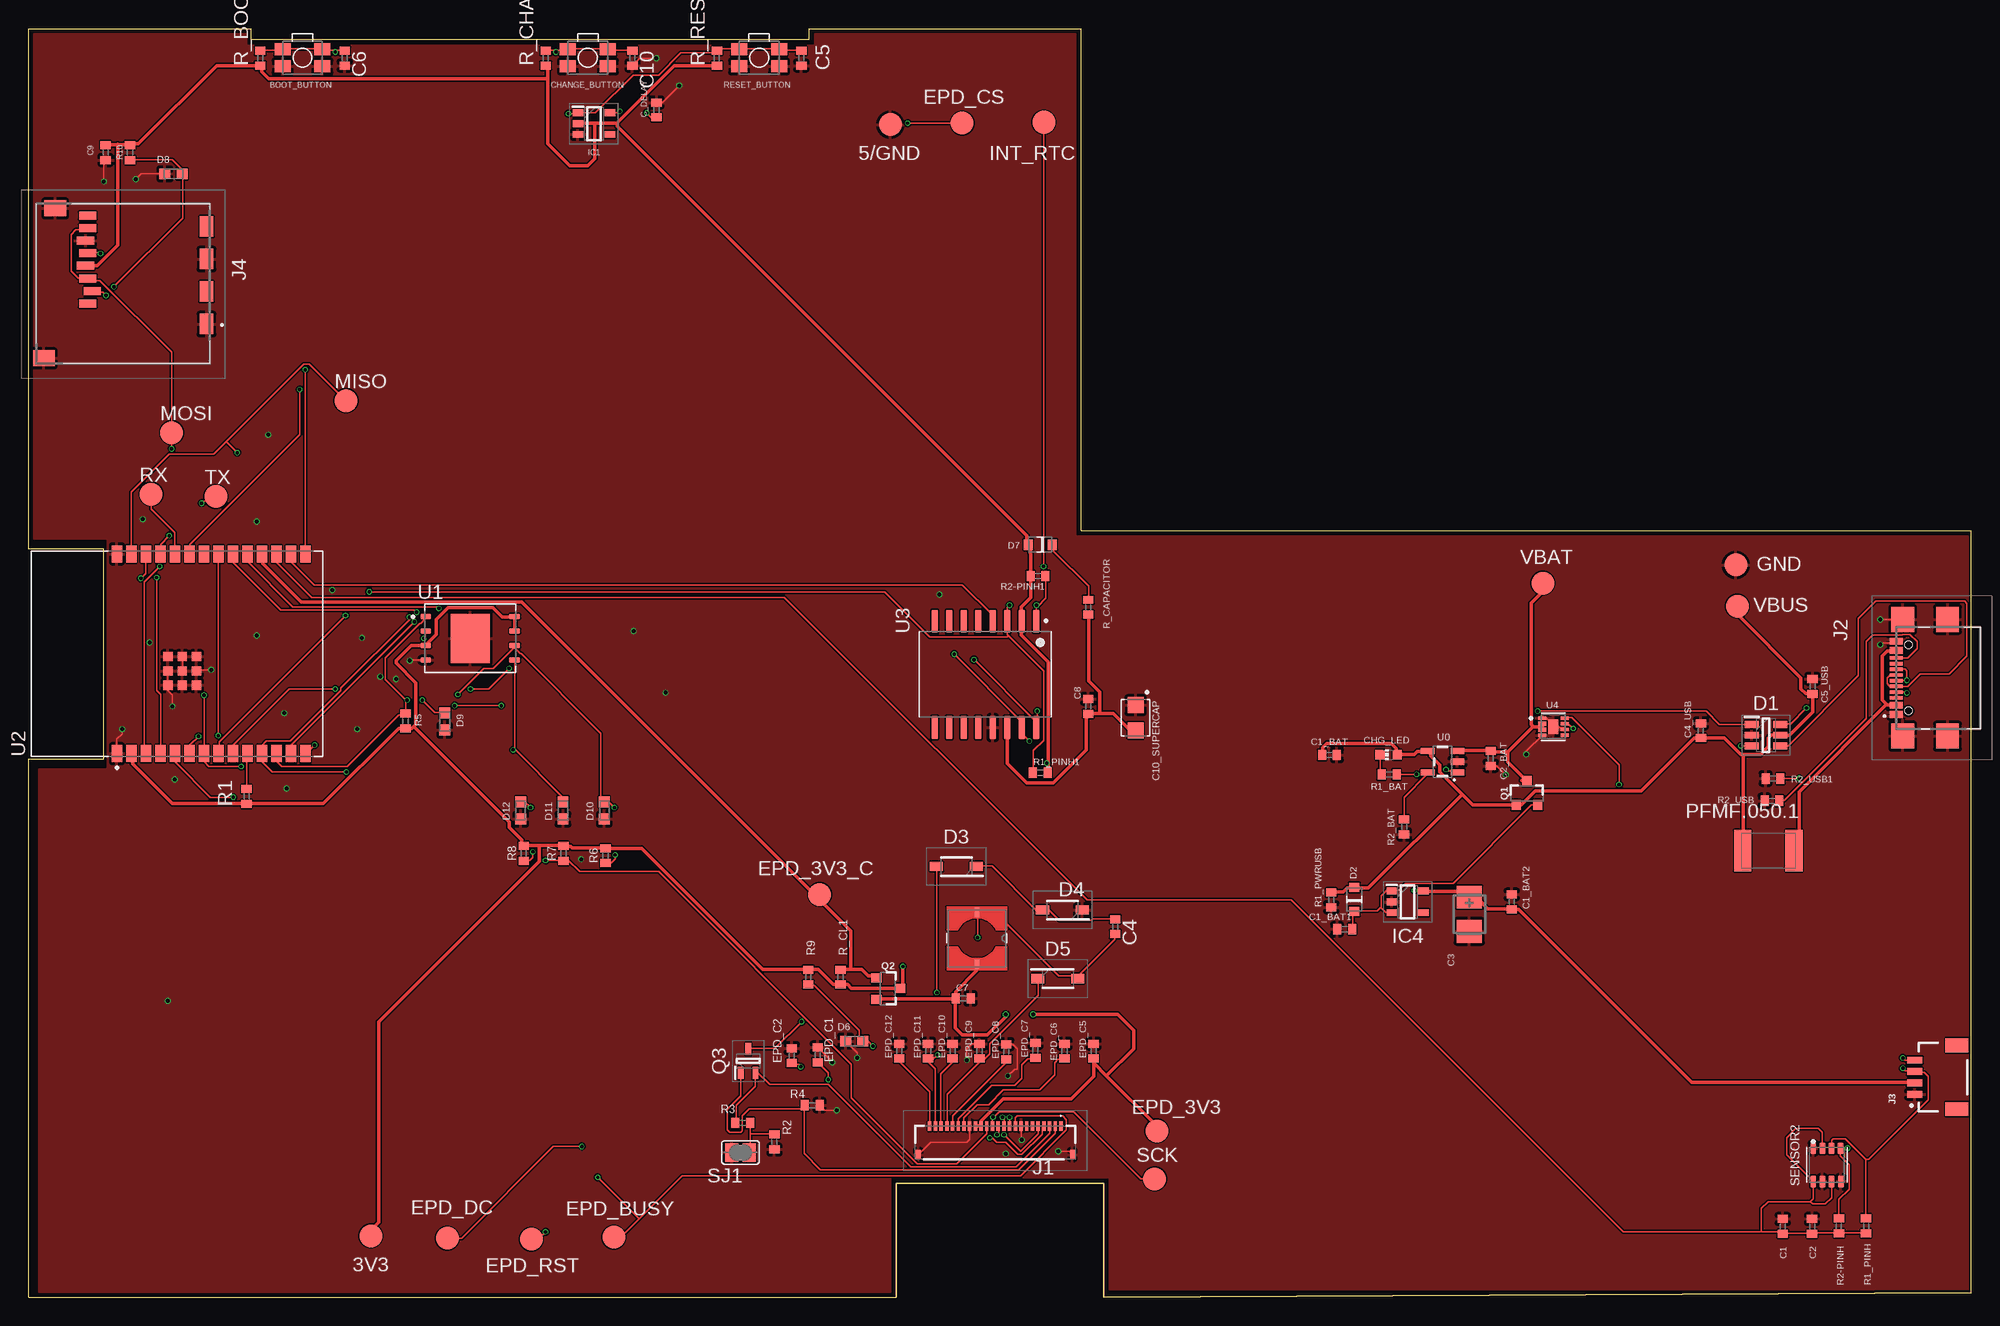
[diagram p1: board, top side]
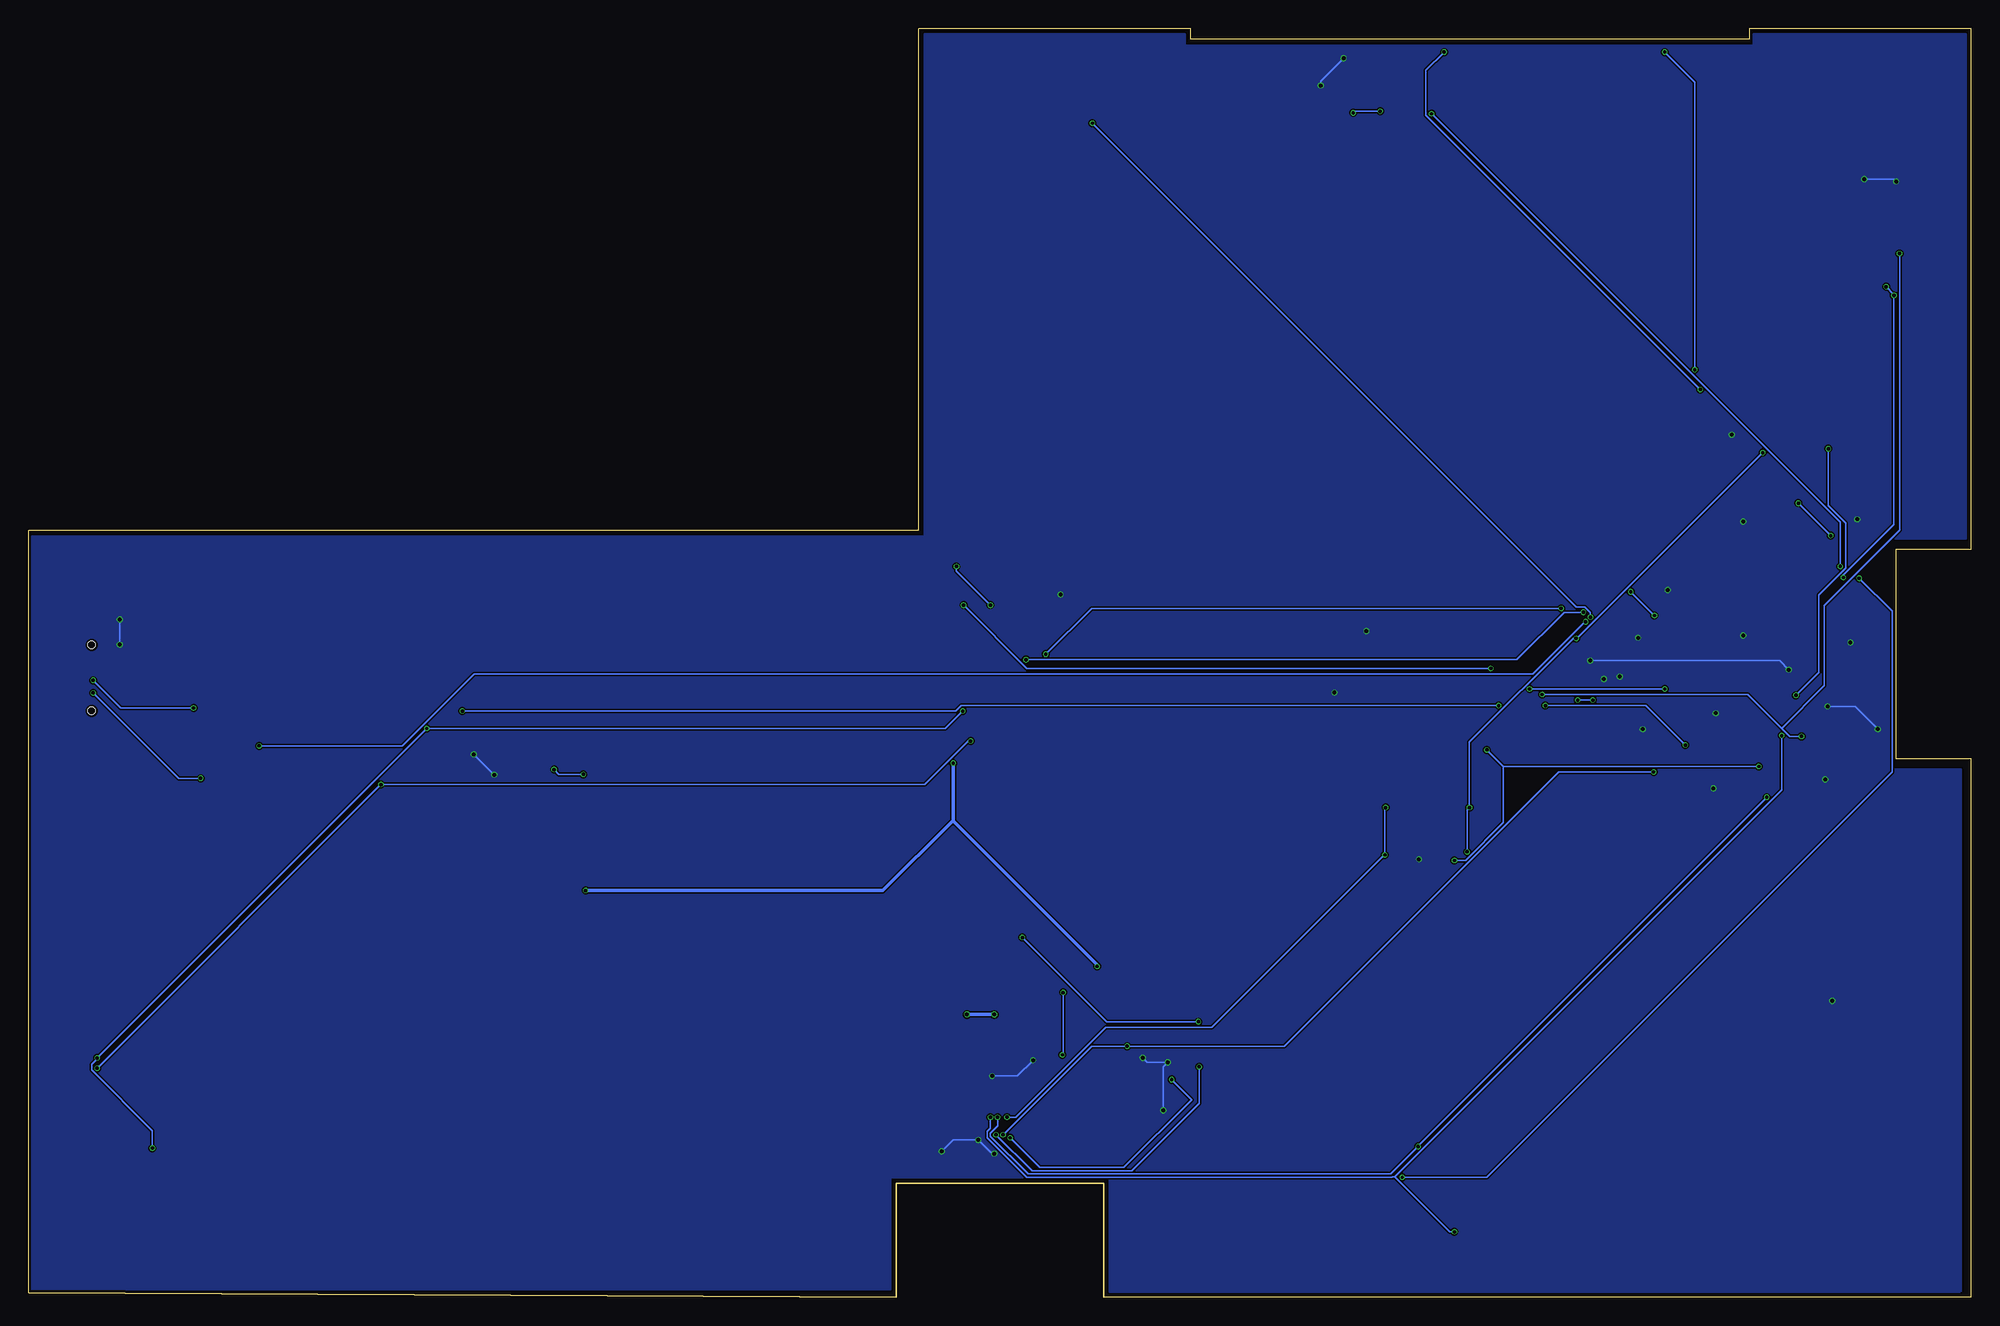
[diagram p2: board, bottom side, seen from below]

Size 170.2 x 111.2 mm. Coordinates in mm from the lower left corner, seen from the top.
Outline: 92.2,67.2 170.2,67.2 170.2,0.4 94.2,0 94.2,10 76,10 76,0 0,0 0,47.2 6.6,47.2 6.6,65.6 0,65.6 0,111.2 19.47,111.2 19.47,110.27 68.39,110.27 68.39,111.2 92.2,111.2 92.2,67.2
Copper layers (1*16): Top 0.035mm / dielectric 1.6mm / Bottom 0.035mm
Design rules "jlcpcb-2layers.dru *": minimum track width 0.15mm, minimum drill 0.3mm, track to track 5mil, track to pad 5mil, pad to pad 5mil, via to via 5mil, smd to smd 5mil, copper to edge 0.2mm, drill to drill 6mil, minimum pad ring 10mil, minimum via ring 3mil, stop-mask expansion 4mil, vias tented up to drill 0mil, thermal gap 10mil

### Footprints (pad centres in the part's own frame; a part is rotated, then mirrored left to right if it is on the bottom)
TP20R = smd 2 x 2: TP 0,0
MYBUTTON = smd 1.4 x 1.05: 1 1.75,0.75; 2 -1.75,0.75; 3 -1.75,-0.75; 4 1.75,-0.75
ESP32_WROVER_EAGLE-LTSPICE_C0402 = smd 0.7 x 0.9: 1 -0.65,0; 2 0.65,0
RCL_CT3528 = smd 2 x 2.2: + -1.5,0; - 1.5,0
CAPCP3225X100N = smd 1.4 x 1.4: 1 -1.1,0; 2 1.1,0
ADAFRUIT_CHIP-LED0603 = smd 0.8 x 0.8: A 0,-0.75; C 0,0.75
SOT95P280X145-6N = smd 1.2 x 0.6: 1 -1.25,0.95; 2 -1.25,0; 3 -1.25,-0.95; 4 1.25,-0.95; 5 1.25,0; 6 1.25,0.95
ESP32_WROVER_AVX---SD0805S020S1R0_AVX_SD0805S020S1R0_0 = smd 0.8 x 0.9: 1 -1.05,0; 2 1.05,0
SOD3716X135N = smd 1.15 x 0.8: 1 -1.75,0; 2 1.75,0
DIOC1608X36N = smd 0.97 x 0.94: 1 -0.75,0; 2 0.75,0
SOT95P280X125-5N = smd 0.9 x 0.6: 1 -1.4,0.95; 2 -1.4,0; 3 -1.4,-0.95; 4 1.4,-0.95; 5 1.4,0.95
SOT95P280X120-5N = smd 0.9 x 0.6: 1 -1.4,0.95; 2 -1.4,0; 3 -1.4,-0.95; 4 1.4,-0.95; 5 1.4,0.95
FH34SRJ24S05SH99 = smd 0.3 x 0.8: 1 5.75,1.45; 2 5.25,1.45; 3 4.75,1.45; 4 4.25,1.45; 5 3.75,1.45; 6 3.25,1.45; 7 2.75,1.45; 8 2.25,1.45; 9 1.75,1.45; 10 1.25,1.45; 11 0.75,1.45; 12 0.25,1.45; 13 -0.25,1.45; 14 -0.75,1.45; 15 -1.25,1.45; 16 -1.75,1.45; 17 -2.25,1.45; 18 -2.75,1.45; 19 -3.25,1.45; 20 -3.75,1.45; 21 -4.25,1.45; 22 -4.75,1.45; 23 -5.25,1.45; 24 -5.75,1.45 | smd 0.4 x 0.8: MP1 6.75,-1.05; MP2 -6.75,-1.05
SAMACSYS_PARTS_USB4110GFA = smd 0.3 x 1.15: A1 -3.35,3.678; A4 -2.55,3.678; A5 -1.25,3.678; A6 -0.25,3.678; A7 0.25,3.678; A8 1.25,3.678; A9 2.55,3.678; A12 3.35,3.678; B1 3.05,3.678; B4 2.25,3.678; B5 1.75,3.678; B6 0.75,3.678; B7 -0.75,3.678; B8 -1.75,3.678; B9 -2.25,3.678; B12 -3.05,3.678 | smd 2.18 x 2: MP1 -5.11,-0.827; MP2 5.11,-0.827; MP3 -5.11,3.103; MP4 5.11,3.103 | hole 0.65: -2.89,2.603; 2.89,2.603
JST04_1MM_RA = smd 0.6 x 1.35: 1 -1.5,0; 2 -0.5,0; 3 0.5,0; 4 1.5,0 | smd 1.2 x 2: NC1 2.8,-3.675; NC2 -2.8,-3.675
112ATAARR03ATTEND = smd 1.8 x 1.2: G1 10.6,10.4; G2 4.9,10.4; S1 7.75,10.4; S2 2.05,10.4 | smd 1.4 x 1.9: G3 13.6,-3.85; G4 0.45,-2.85 | smd 0.7 x 1.5: P1 8.8,0; P2 7.7,0.4; P3 6.6,0; P4 5.5,-0.2; P5 4.4,0; P6 3.3,-0.2; P7 2.2,0; P8 1.1,0
IND_4828-WE-TPC_WRE = smd 0.813 x 0.406: 1 -2.286,0; 2 2.286,0
ESP32C6_VARISTOR_CT/CN1812 = smd 1.5 x 3.6: 1 -2.25,0; 2 2.25,0
ESP32_WROVER_SPARKFUN-DISCRETESEMI_SOT23-3 = smd 0.8 x 0.9: 1 -0.95,-1; 2 0.95,-1; 3 0,1.1
SOT65P210X110-3N = smd 1.05 x 0.5: 1 -1.05,0.65; 2 -1.05,-0.65; 3 1.05,0
ESP32_WROVER_EAGLE-LTSPICE_R0402 = smd 0.7 x 0.9: 1 -0.65,0; 2 0.65,0
ESP32_WROVER_BME680_PSON80P300X300X100-8N = smd 1.016 x 0.5: 1 1.458,1.2; 2 1.458,0.4; 3 1.458,-0.4; 4 1.458,-1.2; 5 -1.458,-1.22; 6 -1.458,-0.4; 7 -1.458,0.4; 8 -1.458,1.2
SJ = smd 1.168 x 1.6: 1 -0.762,0; 2 0.762,0
ESP32_WROVER_SPARKFUN-IC-POWER_SOT23-5 = smd 0.55 x 1.2: 1 -0.95,-1.3; 2 0,-1.3; 3 0.95,-1.3; 4 0.95,1.3; 5 -0.95,1.3
SON127P600X800X80-9N = smd 0.94 x 0.44: 1 -3.895,1.905; 2 -3.895,0.635; 3 -3.895,-0.635; 4 -3.895,-1.905; 5 3.895,-1.905; 6 3.895,-0.635; 7 3.895,0.635; 8 3.895,1.905 | smd 3.4 x 4.3: 9 0,0
XCVR_ESP32-C6-WROOM-1-N8 = smd 1.5 x 0.9: 1 -8.75,5.26; 2 -8.75,3.99; 3 -8.75,2.72; 4 -8.75,1.45; 5 -8.75,0.18; 6 -8.75,-1.09; 7 -8.75,-2.36; 8 -8.75,-3.63; 9 -8.75,-4.9; 10 -8.75,-6.17; 11 -8.75,-7.44; 12 -8.75,-8.71; 13 -8.75,-9.98; 14 -8.75,-11.25; 15 8.75,-11.25; 16 8.75,-9.98; 17 8.75,-8.71; 18 8.75,-7.44; 19 8.75,-6.17; 20 8.75,-4.9; 21 8.75,-3.63; 22 8.75,-2.36; 23 8.75,-1.09; 24 8.75,0.18; 25 8.75,1.45; 26 8.75,2.72; 27 8.75,3.99; 28 8.75,5.26 | smd 0.8 x 0.8: 29_1 -2.755,0.79; 29_2 -1.505,0.79; 29_3 -0.255,0.79; 29_4 -2.755,-0.46; 29_5 -1.505,-0.46; 29_6 -0.255,-0.46; 29_7 -2.755,-1.71; 29_8 -1.505,-1.71; 29_9 -0.255,-1.71
SOIC127P1032X265-16N = smd 2.05 x 0.59: 1 -4.655,4.445; 2 -4.655,3.175; 3 -4.655,1.905; 4 -4.655,0.635; 5 -4.655,-0.635; 6 -4.655,-1.905; 7 -4.655,-3.175; 8 -4.655,-4.445; 9 4.655,-4.445; 10 4.655,-3.175; 11 4.655,-1.905; 12 4.655,-0.635; 13 4.655,0.635; 14 4.655,1.905; 15 4.655,3.175; 16 4.655,4.445
SON50P200X200X80-9N = smd 0.76 x 0.27: 1 -0.985,0.75; 4 -0.985,-0.75; 5 0.985,-0.75; 6 0.985,-0.25; 7 0.985,0.25; 8 0.985,0.75 | smd 0.813 x 0.406: 2 -0.985,0.25; 3 -0.985,-0.25 | smd 0.9 x 1.3: 9 0,0

### Placement (x,y rotation side)
3V3  29.99,5.39 0 top
5/GND  75.49,102.79 0 top
BOOT_BUTTON  24,108.63 180 top
C1  153.66,6.23 90 top
C1_BAT  113.96,47.55 0 top
C1_BAT1  115.29,32.28 180 top
C1_BAT2  129.93,34.67 90 top
C2  156.24,6.23 90 top
C2_BAT  128.08,47.23 270 top
C3  126.21,33.58 270 top
C4  95.2,32.5 270 top
C4_USB  146.5,49.67 90 top
C5  67.7,108.6 270 top
C5_USB  156.28,53.55 90 top
C6  27.7,108.6 270 top
C7  81.88,26.2 0 top
C8  92.84,51.8 90 top
C9  6.75,100.33 270 top
C10  52.9,108.6 270 top
C10_SUPERCAP  96.98,50.8 270 top
C_DELAY  55.01,104.07 90 top
CHANGE_BUTTON  49,108.63 180 top
CHG_LED  119.14,47.56 90 top
D1  152.2,49.27 0 top
D2  116.14,34.88 90 top
D3  81.28,37.76 180 top
D4  90.57,33.95 180 top
D5  90.17,27.94 0 top
D6  72.33,22.46 0 top
D7  88.63,65.97 180 top
D8  12.7,98.46 0 top
D9  36.46,50.47 90 top
D10  50.44,42.67 90 top
D11  46.82,42.67 90 top
D12  43.11,42.68 90 top
EPD_3V3  98.84,14.59 0 top
EPD_3V3_C  69.29,35.31 0 top
EPD_BUSY  51.27,5.29 0 top
EPD_C1  69.13,21.26 90 top
EPD_C2  66.85,21.19 90 top
EPD_C5  93.3,21.59 90 top
EPD_C6  90.75,21.59 90 top
EPD_C7  88.2,21.66 90 top
EPD_C8  85.65,21.54 90 top
EPD_C9  83.3,21.59 90 top
EPD_C10  80.95,21.59 90 top
EPD_C11  78.8,21.59 90 top
EPD_C12  76.27,21.59 90 top
EPD_CS  81.79,102.91 0 top
EPD_DC  36.69,5.19 0 top
EPD_RST  44.04,5.11 0 top
GND  149.57,64.19 0 top
IC1  49.53,102.87 0 top
IC4  120.81,34.67 0 top
INT_RTC  88.94,102.99 0 top
J1  84.69,13.57 0 top
J2  167.28,54.3 90 top
J3  165.23,19.3 90 top
J4  5.19,95.9 270 top
L1  83.08,31.48 270 top
MISO  27.81,78.59 0 top
MOSI  12.53,75.79 0 top
PFMF.050.1  152.41,39.15 180 top
Q1  131.26,44.16 0 top
Q2  75.27,27.07 270 top
Q3  63.04,20.72 90 top
R1  19.1,43.91 90 top
R1_BAT  119.19,45.83 0 top
R1_PINH  160.97,6.27 270 top
R1_PINH1  88.63,45.99 0 top
R1_PWRUSB  114.12,34.84 90 top
R2  65.34,13.63 90 top
R2-PINH  158.59,6.27 270 top
R2-PINH1  88.43,63.23 180 top
R2_BAT  120.5,41.23 90 top
R2_USB  152.73,43.53 180 top
R2_USB1  152.81,45.47 0 top
R3  62.57,15.3 180 top
R4  68.65,16.85 180 top
R5  33.02,50.51 270 top
R6  50.54,38.71 90 top
R7  46.86,38.91 90 top
R8  43.38,38.91 90 top
R9  68.3,28.07 90 top
R10  8.89,100.33 90 top
R_BOOT  20.3,108.6 90 top
R_CAPACITOR  92.84,60.49 90 top
R_CHANGE  45.3,108.6 90 top
R_CL1  71.13,28.07 90 top
R_RESET  60.3,108.6 90 top
RESET_BUTTON  64,108.63 180 top
RX  10.73,70.39 0 top
SCK  98.65,10.39 0 top
SENSOR2  157.54,11.62 90 top
SJ1  62.37,12.7 0 top
TX  16.41,70.19 0 top
U0  123.87,46.95 90 top
U1  38.69,57.76 0 top
U2  13,56.41 90 top
U3  83.82,54.61 270 top
U4  133.57,50.02 0 top
VBAT  132.65,62.59 0 top
VBUS  149.69,60.59 0 top

### Tracks (layer width: path | path; a pad name or v marks a point on that pad's centre or on a via)
3V3  (via drill 0.3)
  Top 0.3: 45.5,106.78 45.5,107.75 45.36,107.89 R_CHANGE.1 | 48.13,102.91 IC1.2 48.27,102.91 49.6,102.91 | 51.52,102.91 56.58,107.96 60.25,107.96 R_RESET.1 | 49.6,102.91 51.52,102.91 | 7.76,101.04 8.86,101.04 R10.2 9,101.11 9.63,101.11 16.48,107.96 R_BOOT.1 20.43,107.89 20.43,107.41 21.05,106.78 45.5,106.78 | 7.76,101.04 6.79,101.04 C9.1 | J4.P4 5.05,90.44 6.03,90.44 7.8,92.22 7.8,100.99 7.76,101.04 | J3.2 165.23,18.84 145.7,18.84 130.54,34 130.05,34 C1_BAT2.1 129.91,34.07 127.83,34.07 126.94,34.97 126.31,34.97 C3.+ 126.17,35.11 125.69,35.59 122.23,35.59 IC4.5 122.09,35.66 v121.39,35.66 | U2.2 9.07,47.64 9.14,47.58 9.14,46.74 12.6,43.28 19.04,43.28 R1.1 19.25,43.28 25.83,43.28 32.41,49.86 R5.2 33.59,49.86 33.76,50.03 | U1.7 42.59,58.45 42.59,59.62 U1.8 42.45,59.69 42.17,59.69 42.1,59.62 41.48,59.62 40.65,60.45 36.77,60.45 35.73,59.42 35.73,58.1 34.83,57.2 U1.3 34.76,57.13 33.53,57.13 32.2,55.8 32.2,55.59 33.93,53.86 33.93,50.21 33.76,50.03 | 89.33,46.81 89.33,55.68 86.98,58.03 86.98,59.21 U3.2 86.98,59.42 86.98,60.52 87.81,61.35 87.81,63.09 R2-PINH1.2 87.81,63.29 87.81,65.16 87.74,65.23 87.74,65.79 87.6,65.93 D7.2 87.46,66.06 87.46,66.76 51.59,102.63 51.59,102.77 51.52,102.91 | 89.33,46.81 89.33,46.05 R1_PINH1.2 | 44.74,39.61 46.81,39.61 R7.2 46.95,39.54 47.51,39.54 47.64,39.4 50.48,39.4 R6.2 50.69,39.33 53.74,39.33 64.33,28.74 68.21,28.74 R9.2 68.35,28.74 69.18,28.74 70.5,27.42 R_CL1.1 71.26,27.42 71.74,27.42 72.09,27.08 76.31,27.08 Q2.3 76.45,27.15 76.59,27.29 v76.59,29.02 | 44.74,39.61 43.42,39.61 R8.2 43.28,39.68 43.21,39.75 43.21,40.1 42.1,41.2 42.1,41.69 33.76,50.03
  Top 0.3: 44.74,39.61 44.74,38.23 30.68,24.17 30.68,6.58 30.05,5.96 30.05,5.4 3V3.TP | v89.19,46.81 89.33,46.81 | 7.76,101.04 7.8,101.08 | 45.5,106.78 45.5,101.1 47.4,99.2 49,99.2 49.6,99.8 49.6,102.91
  Bottom 0.3: 89.19,41.76 v89.19,46.81 | 89.19,41.76 76.59,29.15 v76.59,29.02 | v121.39,35.66 95.36,35.66 89.33,41.69 89.19,41.76
32KHZ  (via drill 0.3)
  Top 0.15: 88.4,60.56 88.29,60.45 88.29,59.28 U3.1 | 88.4,60.56 89.12,61.29 89.12,63.23 R2-PINH1.1 | v26.87,53.32 22.85,53.32 17.94,48.41 17.94,47.71 U2.9 | v38.71,53.32 40.3,53.32 v42.1,55.12 | 88.4,60.56 v88.29,60.66
  Bottom 0.15: v38.71,53.32 v26.87,53.32 | v42.1,55.12 82.75,55.12 v88.29,60.66
DN
  Top 0.15: J2.A7 163.57,54.57 163.08,54.57 162.81,54.29 162.81,53.81 163.01,53.6 163.57,53.6 J2.B7 163.64,53.53 164.61,53.53 165.72,54.64 168.24,54.64 169.8,56.2 169.8,60.8 169.59,61.01 161.81,61.01 160.3,59.49 160.3,54.48 154.15,48.34 153.46,48.34 D1.4
DP  (via drill 0.3)
  Top 0.15: 164.47,54.08 163.64,54.08 J2.A6 | 164.47,54.08 164.54,54.15 164.54,54.91 164.4,55.05 163.64,55.05 J2.B6 | v155.74,51.66 154.36,50.28 153.46,50.28 D1.6 | v164.54,54.08 164.47,54.08
  Bottom 0.15: v155.74,51.66 162.11,51.66 v164.54,54.08
EPD_3V3  (via drill 0.35)
  Top 0.3: Q2.2 74.31,26.18 81.16,26.18 C7.1 | L1.2 83.03,29.15 83.03,28.6 81.23,26.8 81.23,26.32 C7.1 | J1.16 82.96,15.03 83.38,15.03 J1.15 83.45,15.17 83.45,15.47 85.39,17.41 91.36,17.41 93.3,19.36 EPD_C5.1 93.35,20.91 93.35,20.5 94.42,19.42 | 94.42,19.42 98.82,15.03 98.82,14.61 EPD_3V3.TP | C7.1 81.16,26.04 81.16,23.61 81.78,23 84,23 85.6,24.6 v85.6,24.8 | v88,24.8 95.4,24.8 96.8,23.4 96.8,21.8 94.42,19.42
  Bottom 0.3: v85.6,24.8 v88,24.8
EPD_3V3_C
  Top 0.3: 72.02,28.74 72.99,28.74 73.54,28.18 74.1,28.18 74.24,28.05 Q2.1 | 72.02,28.74 71.19,28.74 R_CL1.2 | U2.18 20.5,65.09 20.5,64.33 23.89,60.94 43.21,60.94 68.83,35.32 69.25,35.32 EPD_3V3_C.TP 69.32,35.18 69.32,34.83 72.02,32.13 72.02,28.74
EPD_BUSY  (via drill 0.3)
  Top 0.15: 53.5,6.89 52.28,5.68 51.66,5.68 51.31,5.33 EPD_BUSY.TP | 53.5,6.89 57.27,10.66 86.92,10.66 90.92,14.67 90.92,15.58 90.58,15.93 86.63,15.93 86.42,15.72 86.42,15.03 J1.9 | v9.83,63.02 10.25,63.43 10.25,65.09 U2.26 | 53.5,6.89 v49.86,10.53
  Bottom 0.15: v49.86,10.53 42.46,10.53 6.95,46.03 6.95,60.14 v9.83,63.02
EPD_CS  (via drill 0.3)
  Top 0.15: v84.83,14.27 84.97,14.4 84.97,14.96 J1.12 | v73.96,22.02 73.54,22.44 73.13,22.44 D6.2 73.06,22.51 72.78,22.78 72.78,23.41 68.83,27.35 68.35,27.35 R9.1 | v27.84,46.05 21.33,46.05 20.5,46.88 20.5,47.64 U2.11 20.43,47.71 20.43,48.34 20.84,48.75 22.92,48.75 27.35,53.18 27.35,53.39 33.38,59.42 v33.38,59.62 | v77.01,102.91 EPD_CS.TP
  Bottom 0.15: v84.83,14.27 77.08,22.02 v73.96,22.02 60.18,22.02 36.15,46.05 v27.84,46.05 | v77.01,102.91 34.62,60.52 33.86,60.52 33.38,60.04 v33.38,59.62
EPD_DC  (via drill 0.3)
  Top 0.15: v85.32,15.79 85.45,15.65 85.45,15.03 J1.11 | v48.48,13.23 45.98,13.23 37.95,5.19 36.7,5.19 EPD_DC.TP | v17.94,43.84 15.93,43.84 12.88,46.88 12.88,47.64 U2.5
  Bottom 0.15: v85.32,15.79 85.32,15.03 85.94,14.4 85.94,14.13 82.64,10.83 50.88,10.83 v48.48,13.23 48.48,13.3 v17.94,43.84
EPD_RST  (via drill 0.3)
  Top 0.15: v85.94,15.79 J1.10 | v45.29,5.75 44.67,5.12 44.04,5.12 EPD_RST.TP | v16.62,49.24 16.62,65.09 U2.21
  Bottom 0.15: v85.94,15.79 85.94,14.82 86.22,14.54 86.22,13.99 82.78,10.55 50.76,10.55 50.75,10.56 50.52,10.56 | 50.52,10.56 45.7,5.75 v45.29,5.75 | v16.62,49.24 16.62,44.46 50.52,10.56
FLASH_CS  (via drill 0.3)
  Top 0.15: 33.03,52.35 33.03,51.18 R5.1 32.96,51.11 32.89,51.04 32.41,51.04 27.91,46.54 22.16,46.54 21.74,46.95 21.74,47.64 U2.12 | U1.1 34.76,59.62 34.76,59.49 34.35,59.07 34.28,59.07 31.25,56.05 31.25,54.13 33.03,52.35 | v34.49,52.35 35.59,51.24 36.42,51.24 D9.2 | v33.17,52.35 33.03,52.35
  Bottom 0.15: v33.17,52.35 v34.49,52.35
GDR
  Top 0.15: J1.2 89.96,14.96 89.96,14.4 86.72,11.17 69.37,11.17 67.93,12.61 67.93,16.83 R4.2 67.86,16.55 63.16,16.55 62.53,15.93 62.53,14.61 62.39,14.47 61.42,14.47 61.22,14.68 61.22,16.48 62.39,17.66 Q3.1
GND  (via drill 0.35)
  Top 0.15: U2.29_5 13.5,54.91 13.5,56.09 U2.29_6 | v87,13.8 86.94,13.86 J1.8 | v90.2,12.8 91.16,12.8 J1.MP1 | J1.MP2 79.02,13.6 82.2,13.6 82.44,13.84 J1.17 | D6.1 72.6,21.44 v72.6,21 | EPD_C1.2 70.4,20.64 v70.4,20.6 | R4.1 69.75,16.4 v70.8,16.4 | 154.68,13.08 154.6,13 | 157.14,9.74 SENSOR2.7 | v82.2,20.8 82.2,21.8 82.64,22.24 EPD_C9.2 | v85.8,19.4 86.4,20 86.6,20 86.6,21.8 86.21,22.19 EPD_C8.2 | v162.2,59.4 v162.21,59.41 J2.MP4 | v162.2,57.2 162.35,57.35 J2.B1 | U2.29_8 14.81,55 v16,55 | v33.4,55.8 33.45,55.85 U1.4 | v8.2,49.8 8.2,49.4 7.74,48.94 U2.1 | v12.6,51.8 12.6,52.8 12.21,53.19 U2.29_1 U2.29_2 | U4.1 132.95,50.77 133.19,50.53 133.19,50.4 U4.9 134.02,50.02 134.11,49.93 134.39,49.93 U4.6 | v6.6,97.8 6.6,99.53 C9.2 | v9.4,98 9.86,98.46 D8.1 | C10.2 53.55,108.6 v55,108.6 | C_DELAY.2 55.52,104.72 v57,106.2 | C2_BAT.2 128.62,46.58 v129.4,45.8 | v131.2,47.6 131.2,47.88 U4.4
  Bottom 0.15: v90.2,12.8 89.2,13.8 v87,13.8 85.8,12.6 v85.6,12.6 | v70.8,16.4 70.8,20.2 v70.4,20.6 72.2,20.6 v72.6,21 | v82.2,20.8 83.6,19.4 v85.8,19.4 | v162.2,57.2 v162.2,59.4 | v33.4,55.8 16.8,55.8 v16,55 | v8.2,49.8 10.2,51.8 v12.6,51.8 | v6.6,97.8 6.8,98 v9.4,98 | v55,108.6 57,106.6 v57,106.2 | v129.4,45.8 v131.2,47.6
  other vias: 20,58 20,68 21,75.6 10.6,57.4 10,68.2 12.8,45.4 22.6,44.6 28.8,49.8 30.8,54.4 32.2,54.2 29.2,57.8 22.4,51.2 26.6,62 79.8,61.6 48.4,38.4 12.2,26 53,58.4 55.8,53
  pour Bottom: 6.86,46.36 6.84,46.34 6.82,46.32 0.88,46.32 0.88,0.5 75.48,10.47 75.48,10.48 75.49,10.48 75.5,10.48 75.51,10.48 94.62,10.48 94.64,10.46 94.66,10.44 94.68,10.42 94.68,0.68 169.92,0.68 169.92,66.72 91.78,66.72 91.76,66.74 91.74,66.76 91.72,66.78 91.72,110.72 68.88,110.72 68.88,109.78 68.86,109.76 68.84,109.74 68.82,109.72 19.18,109.72 19.16,109.74 19.14,109.76 19.12,109.78 19.12,110.72 0.48,110.72 0.48,66.48 6.82,66.48 6.84,66.46 6.86,66.44 6.88,66.42 6.88,46.38
  pour Top: 6.86,46.36 6.84,46.34 6.82,46.32 0.88,46.32 0.88,0.48 75.52,0.48 75.52,10.42 75.54,10.44 75.56,10.46 75.58,10.48 94.62,10.48 94.64,10.46 94.66,10.44 94.68,10.42 94.68,0.68 169.92,0.68 169.92,66.72 91.78,66.72 91.76,66.74 91.74,66.76 91.72,66.78 91.72,110.72 68.88,110.72 68.88,109.78 68.86,109.76 68.84,109.74 68.82,109.72 19.18,109.72 19.16,109.74 19.14,109.76 19.12,109.78 19.12,110.72 0.48,110.72 0.48,66.48 6.82,66.48 6.84,66.46 6.86,66.44 6.88,66.42 6.88,46.38
  pour Bottom: 0.98,0.48 75.52,0.48 75.52,10.32 10.83,10.32
GPIO8
  Top 0.15: R1.2 19.11,44.6 19.11,47.64 U2.10
I2C_PW
  Top 0.15: 156.37,10.18 SENSOR2.8 | 157.13,13.02 SENSOR2.2 157.14,14.46 156.8,14.8 154.8,14.8 154,14 154,12.5 SENSOR2.8 | 157.89,10.18 SENSOR2.6 | R1_PINH.2 160.94,5.68 158.65,5.68 R2-PINH.2 158.58,5.68 156.23,5.68 C2.1 156.23,5.61 153.67,5.61 C1.1 153.6,5.61 153.46,5.75 151.8,5.75 | 151.8,5.75 139.68,5.75 110.59,34.83 92.73,34.83 66.2,61.35 24.79,61.35 21.74,64.4 21.74,65.09 U2.17 | 157.96,10.11 SENSOR2.6 | SENSOR2.8 156.34,8.66 156.08,8.4 | 156.08,8.4 152.4,8.4 151.8,7.8 151.8,5.75 | SENSOR2.6 157.94,8.74 157.4,8.2 156.28,8.2 156.08,8.4
INT_RTC  (via drill 0.3)
  Top 0.15: 85.83,58 85.73,58.1 85.73,59.21 U3.3 85.73,60.45 v85.94,60.66 | 85.83,58 88.92,54.91 88.92,48.82 88.02,47.92 88.02,46.05 R1_PINH1.1 | v27.77,59.76 16.69,48.68 16.69,47.71 U2.8 | v29.85,61.84 75,61.84 78.94,57.89 85.73,57.89 85.83,58 | v88.92,64.06 88.92,102.97 INT_RTC.TP
  Bottom 0.15: v29.85,61.84 v27.77,59.76 | v88.92,64.06 88.92,63.64 v85.94,60.66
IO/BOOT  (via drill 0.3)
  Top 0.15: R_BOOT.2 20.36,109.28 22.16,109.28 22.23,109.35 BOOT_BUTTON.4 22.3,109.42 25.69,109.42 BOOT_BUTTON.3 25.76,109.35 25.83,109.28 26.87,109.28 | 26.87,109.28 27.7,109.28 C6.1 | v24.24,81.3 24.24,65.16 U2.15 | v26.87,109.14 26.87,109.28
  Bottom 0.15: v24.24,81.3 24.24,106.51 v26.87,109.14
IO/CHANGE  (via drill 0.3)
  Top 0.15: C10.1 52.84,109.28 50.83,109.28 50.76,109.35 CHANGE_BUTTON.3 50.69,109.42 47.3,109.42 CHANGE_BUTTON.4 47.23,109.35 47.16,109.28 46.19,109.28 | 46.19,109.28 45.36,109.28 R_CHANGE.2 | v23.75,79.57 23.75,75.62 14.13,66 14.13,65.16 U2.23 | v46.19,109.14 46.19,109.28
  Bottom 0.15: v23.75,79.57 47.78,103.6 47.78,107.55 v46.19,109.14
MISO  (via drill 0.3)
  Top 0.15: v44.18,39.06 44.18,38.57 43.9,38.3 43.42,38.3 R8.1 | v43.97,42.94 43.49,43.42 43.14,43.42 D12.2 | v34.62,57.76 34.76,57.89 34.76,58.38 U1.2 | 17.31,75 24.1,81.78 24.58,81.78 27.77,78.6 MISO.TP | 17.31,75 16.2,73.89 12.33,73.89 9,70.57 U2.27 | 17.31,75 v18.28,74.03
  Bottom 0.15: v44.18,39.06 44.18,42.73 v43.97,42.94 43.97,48.68 34.9,57.76 v34.62,57.76 34.56,57.76 v18.28,74.03
MOSI  (via drill 0.3)
  Top 0.15: J1.14 83.93,14.96 83.93,14.34 81.32,11.73 77.85,11.73 72.08,17.49 72.08,20.44 55.19,37.33 48.27,37.33 47.3,38.3 46.88,38.3 R7.1 46.81,38.3 v45.29,38.3 | J4.P7 5.12,93.69 4.99,93.56 4.16,93.56 3.74,93.14 3.74,89.96 4.36,89.33 5.12,89.33 J4.P3 5.19,89.26 5.33,89.12 6.23,89.12 12.53,82.82 12.53,75.83 MOSI.TP 12.53,75.76 v12.53,74.37 | 42.59,48.06 42.59,55.82 U1.5 | 42.59,48.06 46.81,43.84 46.81,43.49 D11.2 | v18.63,46.54 15.79,46.54 15.37,46.95 15.37,47.64 U2.7 15.37,47.71 v15.37,52.77 | v42.45,47.99 42.52,48.06 42.59,48.06
  Bottom 0.15: 41,46.54 v18.63,46.54 | v42.45,47.99 41,46.54 | v12.53,74.37 12.53,69.39 11.01,67.86 11.01,63.92 13.37,61.55 13.37,54.77 v15.37,52.77 | v45.29,38.3 44.32,38.3 41,41.62 41,46.54
N$1  (via drill 0.3)
  Top 0.15: v155.12,45.5 153.53,45.5 R2_USB1.2 | v164.54,52.98 164.47,53.05 163.64,53.05 J2.A5
  Bottom 0.15: v155.12,45.5 157.06,45.5 v164.54,52.98
N$2
  Top 0.15: R2_USB.1 153.39,43.56 153.8,43.56 160.98,50.73 160.98,57.46 161.54,58.03 164.12,58.03 164.19,58.1 164.81,58.1 165.44,57.48 165.44,56.85 164.61,56.02 163.64,56.02 J2.B5
N$3
  Top 0.15: C1_BAT1.1 115.99,32.34 115.99,33.66 116.13,33.79 D2.1 116.2,33.86 118.14,33.86 118.42,34.14 118.49,34.14 | 118.49,34.14 118.9,33.73 119.39,33.73 IC4.3 | 118.49,34.14 118.49,35.18 118.97,35.66 119.39,35.66 IC4.1 119.46,35.66 120.01,35.66 120.63,36.29 124.79,36.29 131.64,43.14 132.2,43.14 Q1.2
N$4  (via drill 0.3)
  Top 0.15: v121.6,45.84 119.87,45.84 R1_BAT.2 | v124.17,46.26 124.3,46.12 125.07,46.12 125.14,46.05 U0.1
  Bottom 0.15: v121.6,45.84 123.75,45.84 v124.17,46.26
N$5
  Top 0.15: C4.1 95.15,33.17 93.21,33.17 93.07,33.03 90.3,33.03 89.33,34 88.85,34 D4.2 88.78,33.93 88.29,33.93 84.42,37.81 83.03,37.81 D3.1
N$6
  Top 0.15: CHG_LED.C 118.42,47.51 118.42,45.91 118.49,45.84 R1_BAT.1
N$7
  Top 0.15: R_CAPACITOR.2 92.86,61.15 92.86,62.33 89.82,65.37 89.82,65.86 89.75,65.93 D7.1
N$8
  Top 0.15: R2_BAT.2 120.5,41.9 120.5,43.84 122.5,45.84 122.5,45.98 U0.5
N$9
  Top 0.15: J1.24 78.94,18 76.31,20.64 76.31,20.91 EPD_C12.1
N$10  (via drill 0.3)
  Top 0.15: v51.8,103.94 51.66,103.81 50.97,103.81 IC1.5 | v54.15,103.81 54.57,103.39 54.98,103.39 C_DELAY.1
  Bottom 0.15: v51.8,103.94 54.02,103.94 v54.15,103.81
N$11
  Top 0.15: J1.22 79.92,15.03 79.92,19.6 80.95,20.64 80.95,20.91 EPD_C10.1
N$13
  Top 0.15: J1.19 81.44,15.65 84.39,18.6 86.4,18.6 87,19.2 87,20.4 87.51,20.91 87.6,20.91 87.8,20.91 88.09,20.91 88.16,20.98 EPD_C7.1
N$14
  Top 0.15: J1.20 80.95,15.03 80.95,15.93 85.59,20.57 85.59,20.84 EPD_C8.1
N$15
  Top 0.15: J1.18 81.92,15.03 81.92,15.72 83.1,16.9 84.1,16.9 85.4,18.2 88.6,18.2 89.89,19.49 89.89,20.57 90.16,20.84 90.65,20.84 90.72,20.91 EPD_C6.1
N$19  (via drill 0.3)
  Top 0.15: 84.41,13.99 v84.21,13.99 84.41,13.99 84.8,13.6 85.6,13.6 86.67,12.53 87.02,12.53 88.79,14.3 88.79,14.87 J1.4 | EPD_C1.1 69.18,20.57 70.05,19.7 v70.05,19.09
  Bottom 0.15: v84.21,13.99 81.61,11.39 74.24,11.39 68.3,17.34 v70.05,19.09
N$20  (via drill 0.3)
  Top 0.15: v85.45,14.27 86.91,12.81 88.43,14.34 88.43,14.96 J1.5 | v67.66,20.22 67.45,20.43 66.97,20.43 66.89,20.5 EPD_C2.1
  Bottom 0.15: v85.45,14.27 82.29,11.1 73.58,11.1 67.66,17.02 v67.66,20.22
PREVGH
  Top 0.15: J1.21 80.47,15.03 80.47,17.8 83.31,20.64 83.31,20.91 EPD_C9.1 83.38,20.84 83.72,20.84 84.21,21.33 84.21,22.23 88.43,26.45 88.43,27.91 D5.1
PREVGL  (via drill 0.3)
  Top 0.15: J1.23 79.43,20.01 78.81,20.64 78.81,20.91 EPD_C11.1 78.88,20.84 79.22,20.84 v79.64,21.26 | v79.57,26.73 79.57,37.74 D3.2
  Bottom 0.15: v79.57,26.73 79.57,21.33 v79.64,21.26
RESE
  Top 0.15: J1.3 89.47,14.96 89.47,14.4 86.52,11.45 77.29,11.45 70.08,18.66 64.92,18.66 63.85,19.74 63.71,19.74 Q3.2 63.64,19.67 63.64,18.49 61.98,16.83 61.98,15.3 R3.2
RESE'
  Top 0.15: 63.23,14.34 63.23,12.81 63.16,12.74 SJ1.2 | 63.23,14.34 63.23,15.23 R3.1 | 63.23,14.34 65.3,14.34 R2.2
RESET  (via drill 0.3)
  Top 0.15: C5.1 67.66,109.28 65.86,109.28 65.79,109.35 RESET_BUTTON.3 65.72,109.42 62.26,109.42 RESET_BUTTON.4 62.19,109.42 60.45,109.42 60.32,109.28 R_RESET.2 60.25,109.21 60.11,109.07 57.13,109.07 55.19,107.13 52.98,107.13 49.65,103.81 48.2,103.81 IC1.1 48.06,103.81 47.99,103.74 v47.3,103.74 | v11.49,64.06 10.15,62.71 10.15,47.8 U2.3
  Bottom 0.15: v11.49,64.06 11.49,67.93 v47.3,103.74
RTC_RST
  Top 0.15: U2.16 22.99,65.09 22.99,64.47 25.01,62.45 81.8,62.45 84.42,59.83 84.42,59.28 U3.4
RX
  Top 0.15: U2.24 12.81,67.03 10.73,69.11 10.73,70.36 RX.TP
SCK  (via drill 0.3)
  Top 0.15: 84.52,15.75 85.04,16.27 91.55,16.27 97.44,10.39 98.61,10.39 SCK.TP | 84.52,15.75 84.42,15.65 84.42,15.03 J1.13 | v51.38,38.78 51.38,38.43 51.04,38.09 50.55,38.09 R6.1 | v51.31,42.94 50.83,43.42 50.48,43.42 D10.2 50.41,43.49 50.14,43.77 50.14,49.44 43.14,56.44 43.07,56.44 42.59,56.92 42.59,57.06 U1.6 42.52,56.92 40.72,55.12 39.89,55.12 v37.6,52.84 | v14.89,49.17 14.13,48.41 14.13,47.71 U2.6 | v6.3,91.48 6.23,91.55 5.19,91.55 J4.P5 | 84.52,15.75 v84.48,15.79
  Bottom 0.15: v51.31,42.94 51.38,42.87 v51.38,38.78 51.45,38.78 66.55,23.68 75.83,23.68 83.72,15.79 v84.48,15.79 | v14.89,49.17 15.93,49.17 16.64,49.88 | 16.64,49.88 19.6,52.84 v37.6,52.84 | v6.3,91.48 6.3,67.24 12.89,60.66 12.89,53.63 16.64,49.88
SCL  (via drill 0.3)
  Top 0.15: R2-PINH.1 158.58,8.59 159.48,9.49 159.48,11.63 158.72,12.4 158.72,13.02 SENSOR2.4 158.79,13.09 v159.34,13.09 | v135.31,49.86 134.9,50.28 134.62,50.28 U4.7 | v164.19,20.98 164.4,20.77 165.23,20.77 J3.4 | v34,60.04 33.79,60.25 22.09,60.25 17.94,64.4 17.94,65.09 U2.20 | v82.82,55.88 88.22,50.48 88.22,50 U3.16 88.09,50.69 88.36,50.97 v88.36,51.38
  Bottom 0.15: v159.34,13.09 159.34,14.61 164.68,19.94 164.68,20.43 164.19,20.91 v164.19,20.98 v135.31,49.86 89.89,49.86 v88.36,51.38 | v34,60.04 35.66,60.04 39.82,55.88 v82.82,55.88
SDA  (via drill 0.3)
  Top 0.15: 160.94,12.12 160.94,6.92 R1_PINH.1 | 160.94,12.12 159.14,13.92 158.1,13.92 157.96,13.78 157.96,13.09 SENSOR2.3 | v139.33,44.94 139.33,46.67 135.18,50.83 134.97,50.83 134.9,50.76 134.62,50.76 U4.8 | v164.19,20.08 164.4,19.88 165.16,19.88 J3.3 165.3,19.74 166.06,19.74 166.41,19.39 166.41,17.31 161.21,12.12 160.94,12.12 | v35.94,60.39 35.8,60.52 23.13,60.52 19.18,64.47 19.18,65.09 U2.19 | v81.09,56.37 86.98,50.48 86.98,50 U3.15 87.05,49.93 87.05,49.38 v87.67,48.75
  Bottom 0.15: v164.19,20.08 v139.33,44.94 91.69,44.94 87.88,48.75 v87.67,48.75 | v35.94,60.39 77.08,60.39 v81.09,56.37
SRC  (via drill 0.3)
  Top 0.15: C4.2 95.15,31.79 95.15,31.37 91.96,28.18 91.96,27.98 D5.2 91.89,28.18 90.23,28.18 84.69,33.73 83.1,33.73 L1.1 83.14,33.71 v83.14,31.54 | v67.73,24.17 65.37,21.81 63.09,21.81 Q3.3
  Bottom 0.15: v67.73,24.17 75.77,24.17 v83.14,31.54
SS_SD  (via drill 0.3)
  Top 0.15: R10.1 8.93,99.72 12.6,99.72 13.43,98.89 13.43,98.47 D8.2 13.5,98.4 13.5,94.6 v7.48,88.57 | v11.22,63.09 11.22,53.18 11.56,52.84 11.56,47.71 U2.4 | v6.79,87.81 6.51,88.09 5.68,88.09 5.61,88.16 J4.P2
  Bottom 0.15: v11.22,63.09 11.22,63.29 6.79,67.73 v6.79,87.81 6.79,87.88 v7.48,88.57
TX  (via drill 0.3)
  Top 0.15: v12.33,66.76 11.56,66 11.56,65.16 U2.25 | v15.17,69.6 15.37,69.8 16,69.8 16.34,70.15 TX.TP
  Bottom 0.15: v15.17,69.6 v12.33,66.76
USB_D+  (via drill 0.3)
  Top 0.15: v132.2,51.38 146.95,51.38 148.13,50.21 150.9,50.21 D1.1 | v37.33,51.87 v41.41,51.87 | v25.07,48.41 24.31,47.64 U2.14
  Bottom 0.15: v132.2,51.38 88.99,51.38 88.5,51.87 v41.41,51.87 | v37.33,51.87 28.53,51.87 v25.07,48.41
USB_D-  (via drill 0.3)
  Top 0.15: v150,48.34 150.9,48.34 D1.3 | v33.79,59.21 22.92,48.34 22.92,47.71 U2.13
  Bottom 0.15: v150,48.34 137.46,48.34 131.16,54.64 38.43,54.64 33.86,59.21 v33.79,59.21
VBAT
  Top 0.3: 132.61,50 132.61,50.21 U4.2 | 132.61,50 132.61,49.79 U4.3 | U0.3 125.2,47.92 128.04,47.92 C2_BAT.1 128.18,47.78 129.57,47.78 129.59,47.81 | 130.81,45.29 131.23,45.29 Q1.3 129.59,46.93 129.59,47.81 | 131.78,50 132.61,50 | 129.59,47.81 131.78,50 | VBAT.TP 132.61,62.53 132.61,61.84 131.64,60.87 131.64,50.21 131.71,50.14 131.78,50
VBUS
  Top 0.3: R1_PWRUSB.2 114.12,35.52 115.16,35.52 115.51,35.87 116.13,35.87 D2.2 116.27,35.87 117.38,35.87 125.58,44.08 | C1_BAT.1 113.36,47.58 113.36,48.2 113.71,48.54 119.39,48.54 119.8,48.13 119.8,47.64 CHG_LED.A 119.94,47.58 121.39,47.58 121.67,47.85 122.5,47.85 U0.4 122.71,47.85 122.85,47.71 122.85,47.44 123.61,46.67 123.61,46.05 125.58,44.08 | 125.58,44.08 126.52,43.14 130.26,43.14 Q1.1 130.47,43.14 130.74,43.14 131.99,44.39 141.27,44.39 145.91,49.03 146.39,49.03 C4_USB.1 146.53,49.03 148.54,49.03 150,47.58 150.2,47.58 | 150.2,47.58 151.73,47.58 152.42,48.27 152.42,49.03 152.7,49.31 153.39,49.31 D1.5 153.6,49.24 154.22,49.24 156.3,51.31 156.3,52.84 C5_USB.1 156.16,52.91 155.67,52.91 155.26,53.32 155.26,54.29 149.72,59.83 149.72,60.52 VBUS.TP | 150.2,47.58 150.2,39.2 PFMF.050.1.2
VRTC
  Top 0.3: 93.83,51.18 95.01,51.18 96.47,49.72 96.95,49.72 C10_SUPERCAP.2 | 93.83,51.18 92.86,51.18 C8.1 92.8,51.04 92.66,50.9 92.66,47.99 89.75,45.08 87.46,45.08 85.73,46.81 85.73,49.93 U3.14 | 93.83,51.18 93.83,53.05 92.86,54.02 92.86,59.83 R_CAPACITOR.1
VUSB
  Top 0.3: J2.A4 163.64,51.8 163.64,52.01 J2.B9 163.5,51.94 162.81,51.94 | J2.A9 163.64,56.78 163.64,56.58 J2.B4 163.5,56.65 162.81,56.65 162.39,56.23 162.39,52.35 162.81,51.94 | 162.81,51.94 162.67,51.87 155.12,44.32 155.12,39.61 154.7,39.2 PFMF.050.1.1